# EAGLE design kitchensink_esp32_mini (EAGLE 9.6.2)

## Sheet 1 of 6
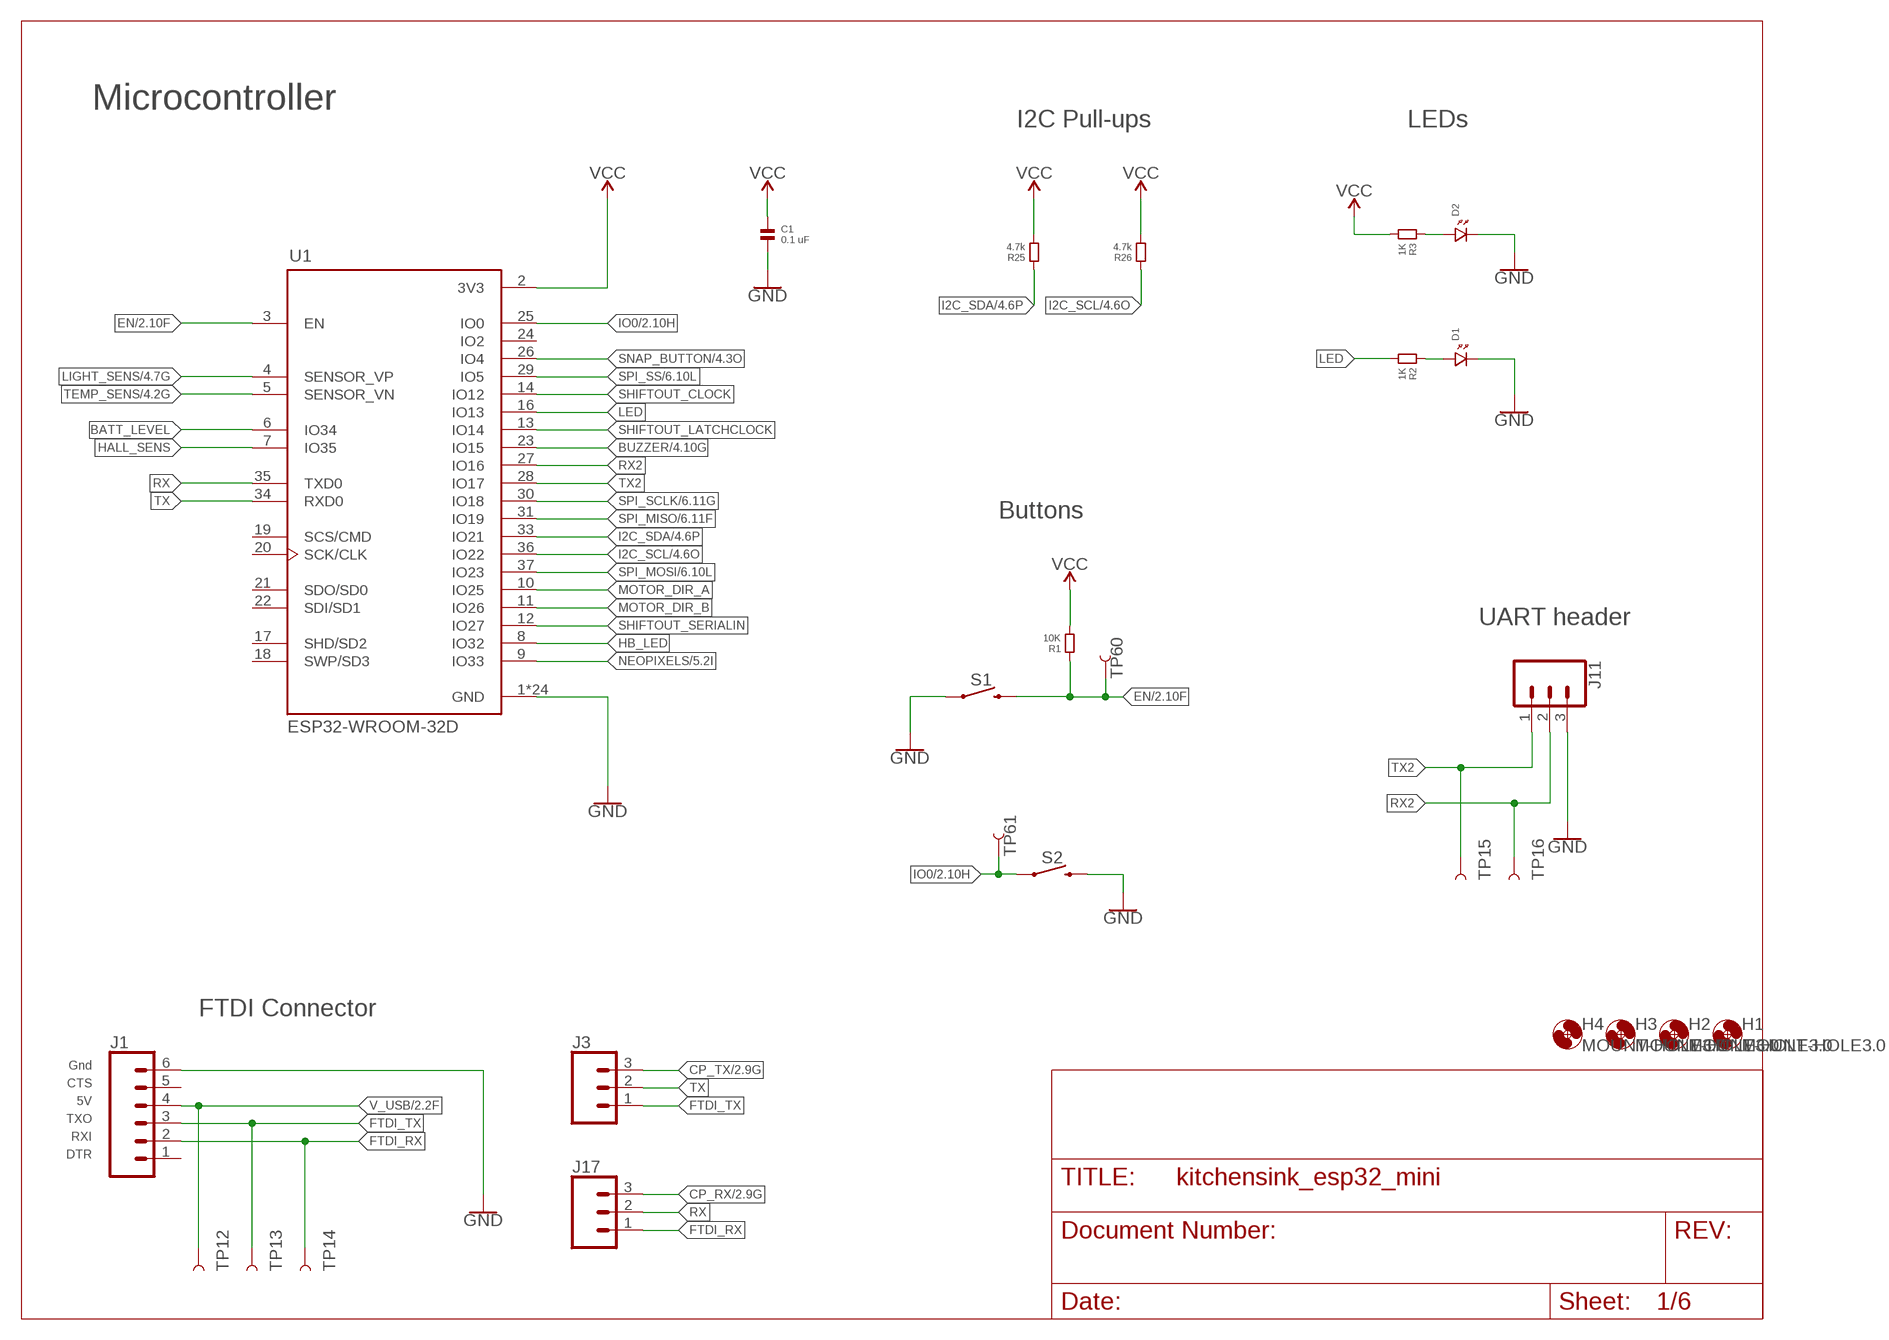
[diagram p0: schematic, sheet 1]

### Parts
C1  0.1 uF  CAPACITOR.1206  [1206]
D1  LED.1206  [1206.LED]
D2  LED.1206  [1206.LED]
H1  MOUNT-HOLE3.0  [3,0]
H2  MOUNT-HOLE3.0  [3,0]
H3  MOUNT-HOLE3.0  [3,0]
H4  MOUNT-HOLE3.0  [3,0]
J1  CONN_06  [1X06-SMD_RA_MALE_NO_HOLES]
J3  CONN_03LONGPADS  [1X03_LONGPADS]
J11  CONN_03SMD_RA_MALE  [1X03_SMD_RA_MALE]
J17  CONN_03LONGPADS  [1X03_LONGPADS]
R1  10K  RESISTOR.1206  [1206]
R2  1K  RESISTOR.1206  [1206]
R3  1K  RESISTOR.1206  [1206]
R25  4.7k  RESISTOR.1206  [1206]
R26  4.7k  RESISTOR.1206  [1206]
S1  MOMENTARY-SWITCH-SPST-SMD-5.2MM  [TACTILE_SWITCH_SMD_5.2MM]
S2  MOMENTARY-SWITCH-SPST-SMD-5.2MM  [TACTILE_SWITCH_SMD_5.2MM]
TP12  TEST-POINT3X5  [PAD.03X.05]
TP13  TEST-POINT3X5  [PAD.03X.05]
TP14  TEST-POINT3X5  [PAD.03X.05]
TP15  TEST-POINT3X5  [PAD.03X.05]
TP16  TEST-POINT3X5  [PAD.03X.05]
TP60  TEST-POINT3X5  [PAD.03X.05]
TP61  TEST-POINT3X5  [PAD.03X.05]
U1  ESP32-WROOM-32D  [MODULE_ESP32-WROOM-32D]

### Nets
BATT_LEVEL: U1.6(IO34)
BUZZER: U1.23(IO15) ; also sheet 4
CP_RX: J17.3 ; also sheet 2
CP_TX: J3.3 ; also sheet 2
EN: R1.1 S1.3 TP60.P$1 U1.3(EN) ; also sheet 2
FTDI_RX: J1.2 J17.1 TP14.P$1
FTDI_TX: J1.3 J3.1 TP13.P$1
GND: D1.P$2 D2.P$2 J1.6 J11.3 S1.1 U1.1(GND) U1.15(GND) U1.38(GND) U1.39_1(GND) U1.39_2(GND) U1.39_3(GND) U1.39_4(GND) U1.39_5(GND) U1.39_6(GND) U1.39_7(GND) U1.39_8(GND) U1.39_9(GND) U1.39_10(GND) U1.39_11(GND) U1.39_12(GND) U1.39_13(GND) U1.39_14(GND) U1.39_15(GND) U1.39_16(GND) U1.39_17(GND) U1.39_18(GND) U1.39_19(GND) U1.39_20(GND) U1.39_21(GND) ; also sheet 2,3,4,5,6
HALL_SENS: U1.7(IO35)
HB_LED: U1.8(IO32)
I2C_SCL: R26.1 U1.36(IO22) ; also sheet 4,6
I2C_SDA: R25.1 U1.33(IO21) ; also sheet 4,6
IO0: S2.1 TP61.P$1 U1.25(IO0) ; also sheet 2
LED: R2.2 U1.16(IO13)
LIGHT_SENS: U1.4(SENSOR_VP) ; also sheet 4
MOTOR_DIR_A: U1.10(IO25)
MOTOR_DIR_B: U1.11(IO26)
N$2: C1.1 ; supply symbol labelled VCC
N$3: C1.2 S2.3 ; supply symbol labelled GND
N$7: D1.P$1 R2.1
N$9: D2.P$1 R3.1
NEOPIXELS: U1.9(IO33) ; also sheet 5
RX: J17.2 U1.35(TXD0)
RX2: J11.2 TP16.P$1 U1.27(IO16)
SHIFTOUT_CLOCK: U1.14(IO12)
SHIFTOUT_LATCHCLOCK: U1.13(IO14)
SHIFTOUT_SERIALIN: U1.12(IO27)
SNAP_BUTTON: U1.26(IO4) ; also sheet 4
SPI_MISO: U1.31(IO19) ; also sheet 6
SPI_MOSI: U1.37(IO23) ; also sheet 6
SPI_SCLK: U1.30(IO18) ; also sheet 6
SPI_SS: U1.29(IO5) ; also sheet 6
TEMP_SENS: U1.5(SENSOR_VN) ; also sheet 4
TX: J3.2 U1.34(RXD0)
TX2: J11.1 TP15.P$1 U1.28(IO17)
V_USB: J1.4 TP12.P$1 ; also sheet 2,3
VCC: R1.2 R3.2 R25.2 R26.2 U1.2(3V3) ; also sheet 2,3,4,5,6
Unconnected: J1.1 J1.5 U1.17(SHD/SD2) U1.18(SWP/SD3) U1.19(SCS/CMD) U1.20(SCK/CLK) U1.21(SDO/SD0) U1.22(SDI/SD1) U1.24(IO2)

### Notes on the sheet
- Microcontroller
- I2C Pull-ups | LEDs
- Buttons
- UART header
- FTDI Connector
- Gnd
- CTS
- 5V
- TXO
- RXI
- DTR

## Sheet 2 of 6
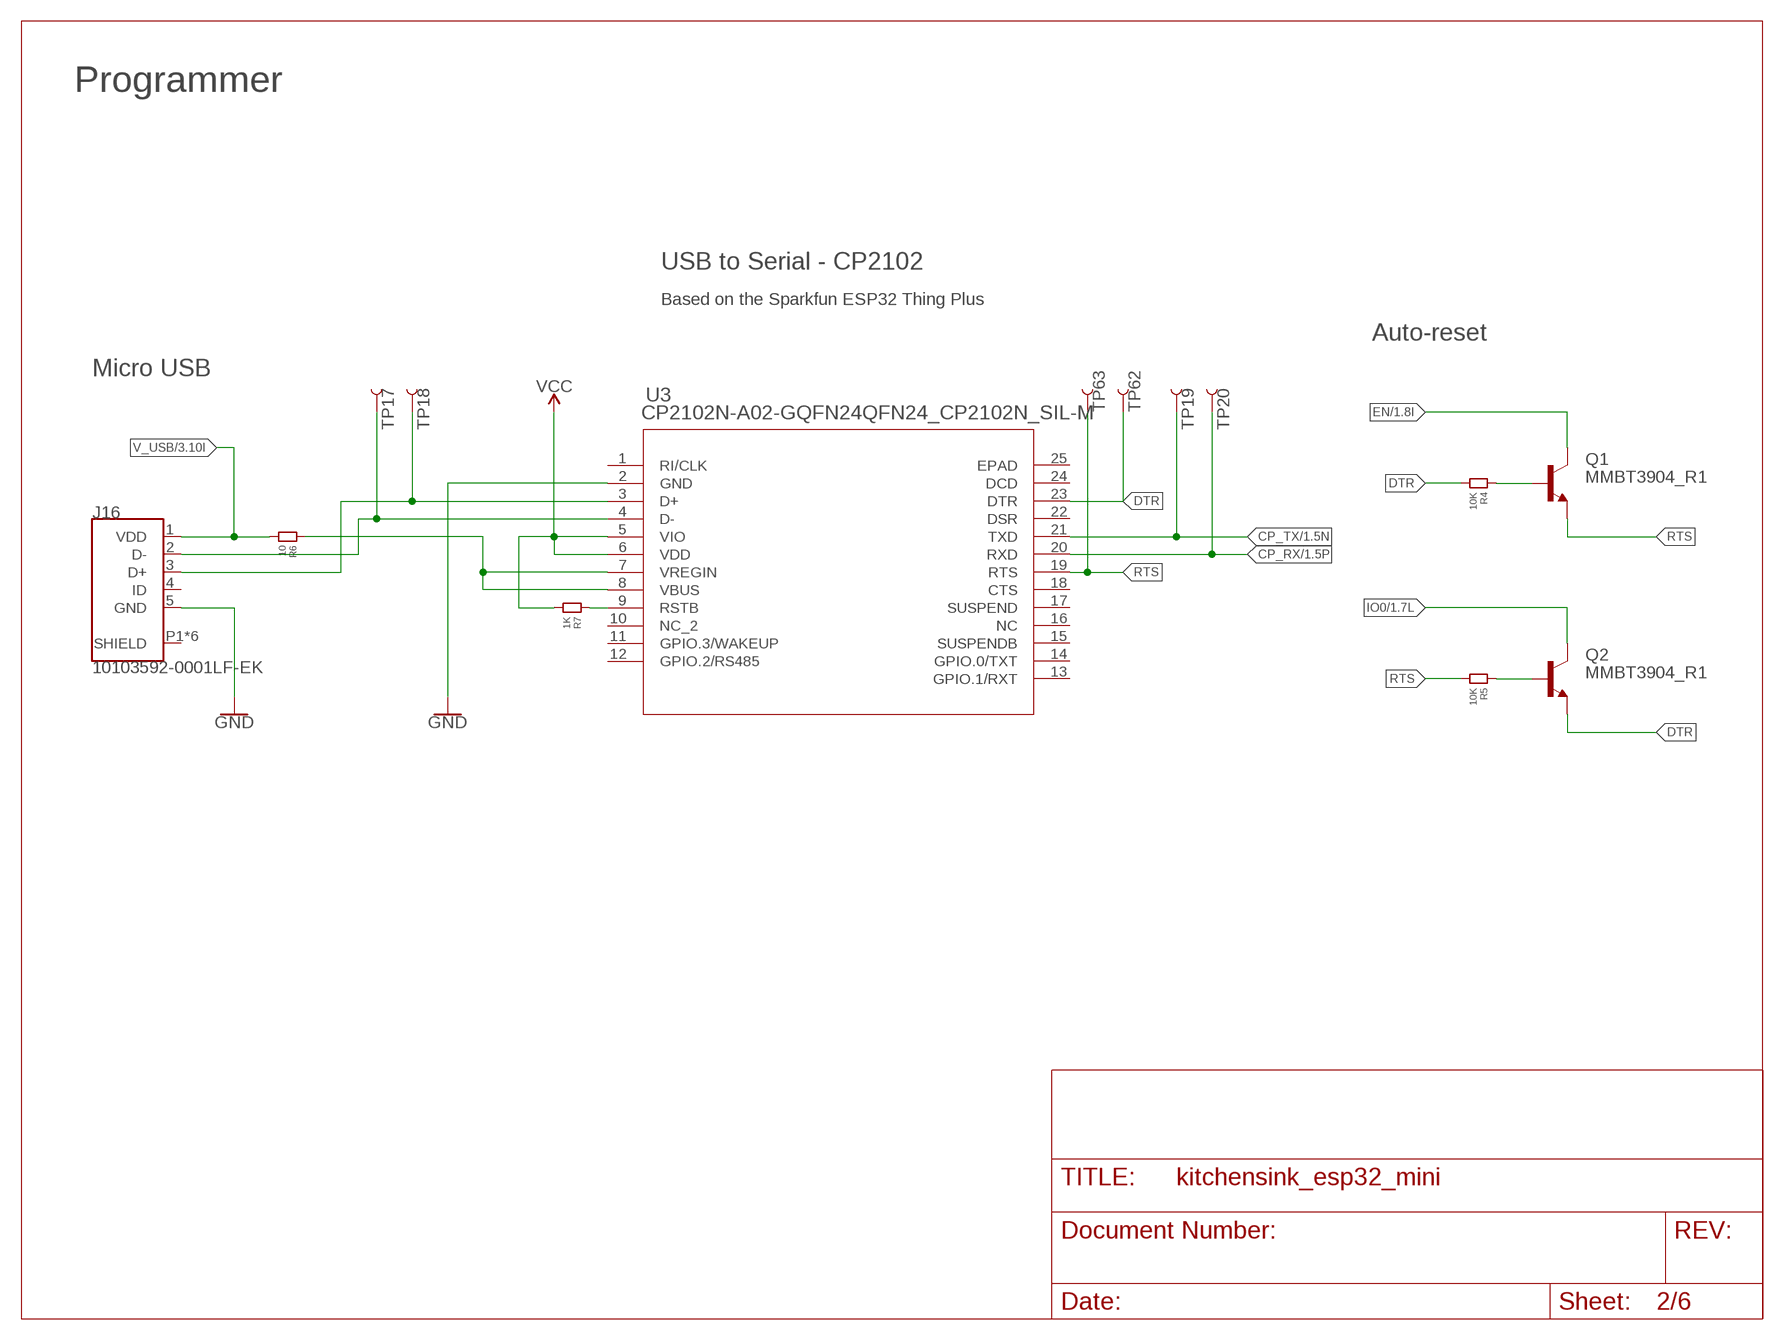
[diagram p1: schematic, sheet 2]

### Parts
J16  10103592-0001LF-EK  [AMPHENOL_10103592-0001LF]
Q1  MMBT3904_R1  BC846  [SOT23]
Q2  MMBT3904_R1  BC846  [SOT23]
R4  10K  RESISTOR.1206  [1206]
R5  10K  RESISTOR.1206  [1206]
R6  10  RESISTOR.1206  [1206]
R7  1K  RESISTOR.1206  [1206]
TP17  TEST-POINT3X5  [PAD.03X.05]
TP18  TEST-POINT3X5  [PAD.03X.05]
TP19  TEST-POINT3X5  [PAD.03X.05]
TP20  TEST-POINT3X5  [PAD.03X.05]
TP62  TEST-POINT3X5  [PAD.03X.05]
TP63  TEST-POINT3X5  [PAD.03X.05]
U3  CP2102N-A02-GQFN24QFN24_CP2102N_SIL-M  [QFN24_CP2102N_SIL-M]

### Nets
CP_RX: TP20.P$1 U3.20(RXD) ; also sheet 1
CP_TX: TP19.P$1 U3.21(TXD) ; also sheet 1
DTR: Q2.2(E) R4.2 TP62.P$1 U3.23(DTR)
EN: Q1.3(C) ; also sheet 1
GND: J16.5(GND) U3.2(GND) ; also sheet 1,3,4,5,6
IO0: Q2.3(C) ; also sheet 1
N$1: R6.1 U3.7(VREGIN) U3.8(VBUS)
N$5: J16.3(D+) TP18.P$1 U3.3(D+)
N$6: J16.2(D-) TP17.P$1 U3.4(D-)
N$10: Q1.1(B) R4.1
N$11: Q2.1(B) R5.1
N$12: R7.1 U3.9(RSTB)
RTS: Q1.2(E) R5.2 TP63.P$1 U3.19(RTS)
V_USB: J16.1(VDD) R6.2 ; also sheet 1,3
VCC: R7.2 U3.5(VIO) U3.6(VDD) ; also sheet 1,3,4,5,6
Unconnected: J16.4(ID) U3.1(RI/CLK) U3.10(NC_2) U3.11(GPIO.3/WAKEUP) U3.12(GPIO.2/RS485) U3.13(GPIO.1/RXT) U3.14(GPIO.0/TXT) U3.15(SUSPENDB) U3.16(NC) U3.17(SUSPEND) U3.18(CTS) U3.22(DSR) U3.24(DCD) U3.25(EPAD)

### Notes on the sheet
- Programmer
- USB to Serial - CP2102
- Based on the Sparkfun ESP32 Thing Plus
- Auto-reset
- Micro USB

## Sheet 3 of 6
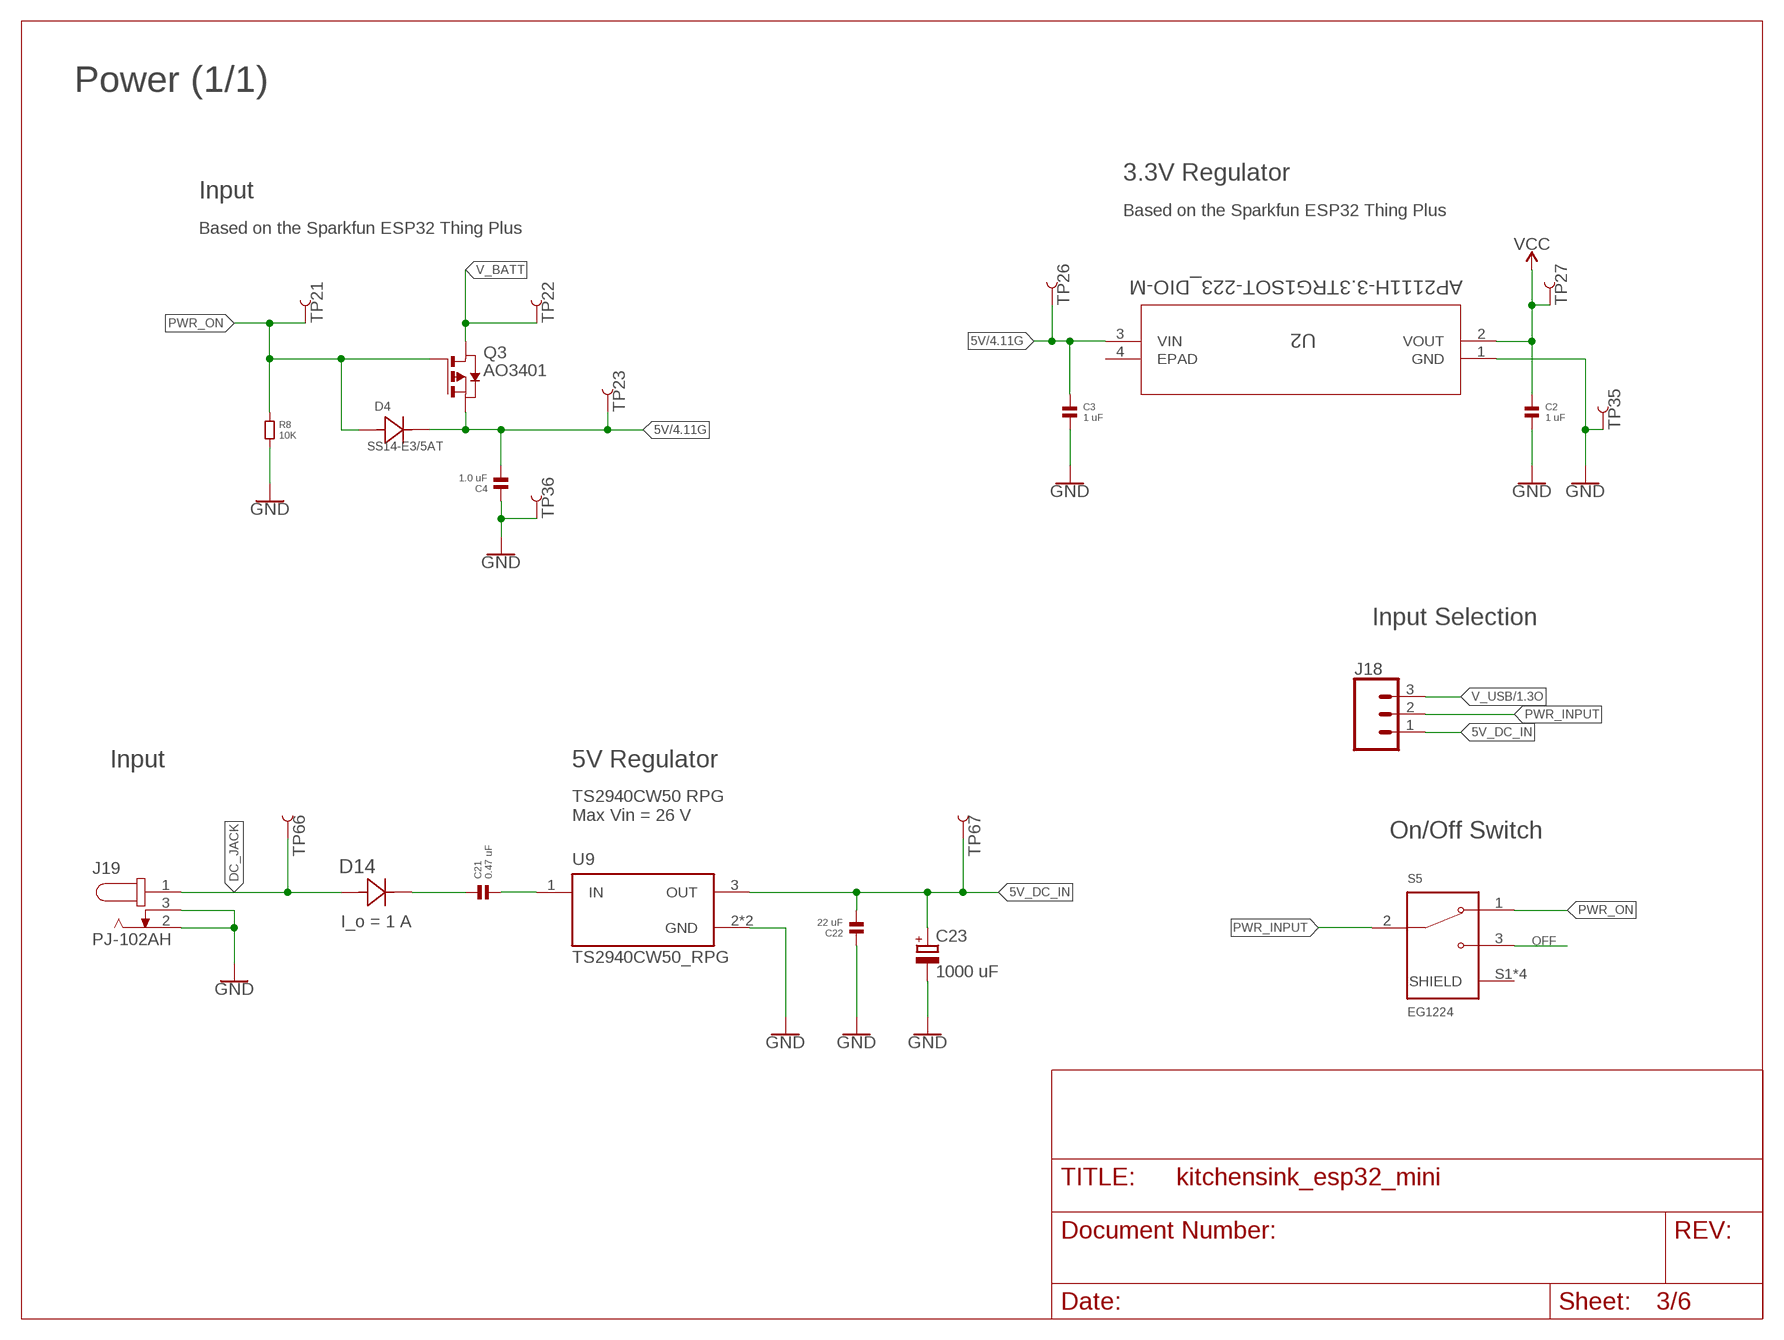
[diagram p2: schematic, sheet 3]

### Parts
C2  1 uF  CAPACITOR.1206  [1206]
C3  1 uF  CAPACITOR.1206  [1206]
C4  1.0 uF  CAPACITOR.1206  [1206]
C21  0.47 uF  CAPACITOR.1206  [1206]
C22  22 uF  CAPACITOR.1206  [1206]
C23  1000 uF  CPOL-EU140CLH-1010  [140CLH-1010]
D4  SS14-E3/5AT  [DIODE_DO214AC]
D14  RS1BB-13-FSMA_DIO-M  [SMA_DIO-M]
J18  CONN_03  [1X03]
J19  PJ-102AH  [CUI_PJ-102AH]
Q3  AO3401  [SOT23]
R8  10K  RESISTOR.1206  [1206]
S5  EG1224  [SW_EG1224]
TP21  TEST-POINT3X5  [PAD.03X.05]
TP22  TEST-POINT3X5  [PAD.03X.05]
TP23  TEST-POINT3X5  [PAD.03X.05]
TP26  TEST-POINT3X5  [PAD.03X.05]
TP27  TEST-POINT3X5  [PAD.03X.05]
TP35  TEST-POINT3X5  [PAD.03X.05]
TP36  TEST-POINT3X5  [PAD.03X.05]
TP66  TEST-POINT3X5  [PAD.03X.05]
TP67  TEST-POINT3X5  [PAD.03X.05]
U2  AP2111H-3.3TRG1SOT-223_DIO-M  [SOT-223_DIO-M]
U9  TS2940CW50_RPG  [VREG_TS2940CW50_RPG]

### Nets
5V: C3.1 C4.2 D4.1 Q3.2(S) TP23.P$1 TP26.P$1 U2.3(VIN) ; also sheet 4,5
5V_DC_IN: C22.2 C23.+ J18.1 TP67.P$1 U9.3(OUT)
DC_JACK: D14.2 J19.1 TP66.P$1
GND: C2.2 C3.2 C4.1 C22.1 C23.- J19.2 J19.3 R8.2 TP35.P$1 TP36.P$1 U2.1(GND) U9.2(GND) U9.4(GND) ; also sheet 1,2,4,5,6
N$32: C21.2 U9.1(IN)
N$43: C21.1 D14.1
OFF: S5.3
PWR_INPUT: J18.2 S5.2
PWR_ON: D4.2 Q3.1(G) R8.1 S5.1 TP21.P$1
V_BATT: Q3.3(D) TP22.P$1
V_USB: J18.3 ; also sheet 1,2
VCC: C2.1 TP27.P$1 U2.2(VOUT) ; also sheet 1,2,4,5,6
Unconnected: S5.S1(SHIELD) S5.S2(SHIELD) S5.S3(SHIELD) S5.S4(SHIELD) U2.4(EPAD)

### Notes on the sheet
- Power (1/1)
- 3.3V Regulator
- Input
- Based on the Sparkfun ESP32 Thing Plus
- Based on the Sparkfun ESP32 Thing Plus
- Input Selection
- Input | 5V Regulator
- TS2940CW50 RPG
  Max Vin = 26 V
- On/Off Switch
- I_o = 1 A

## Sheet 4 of 6
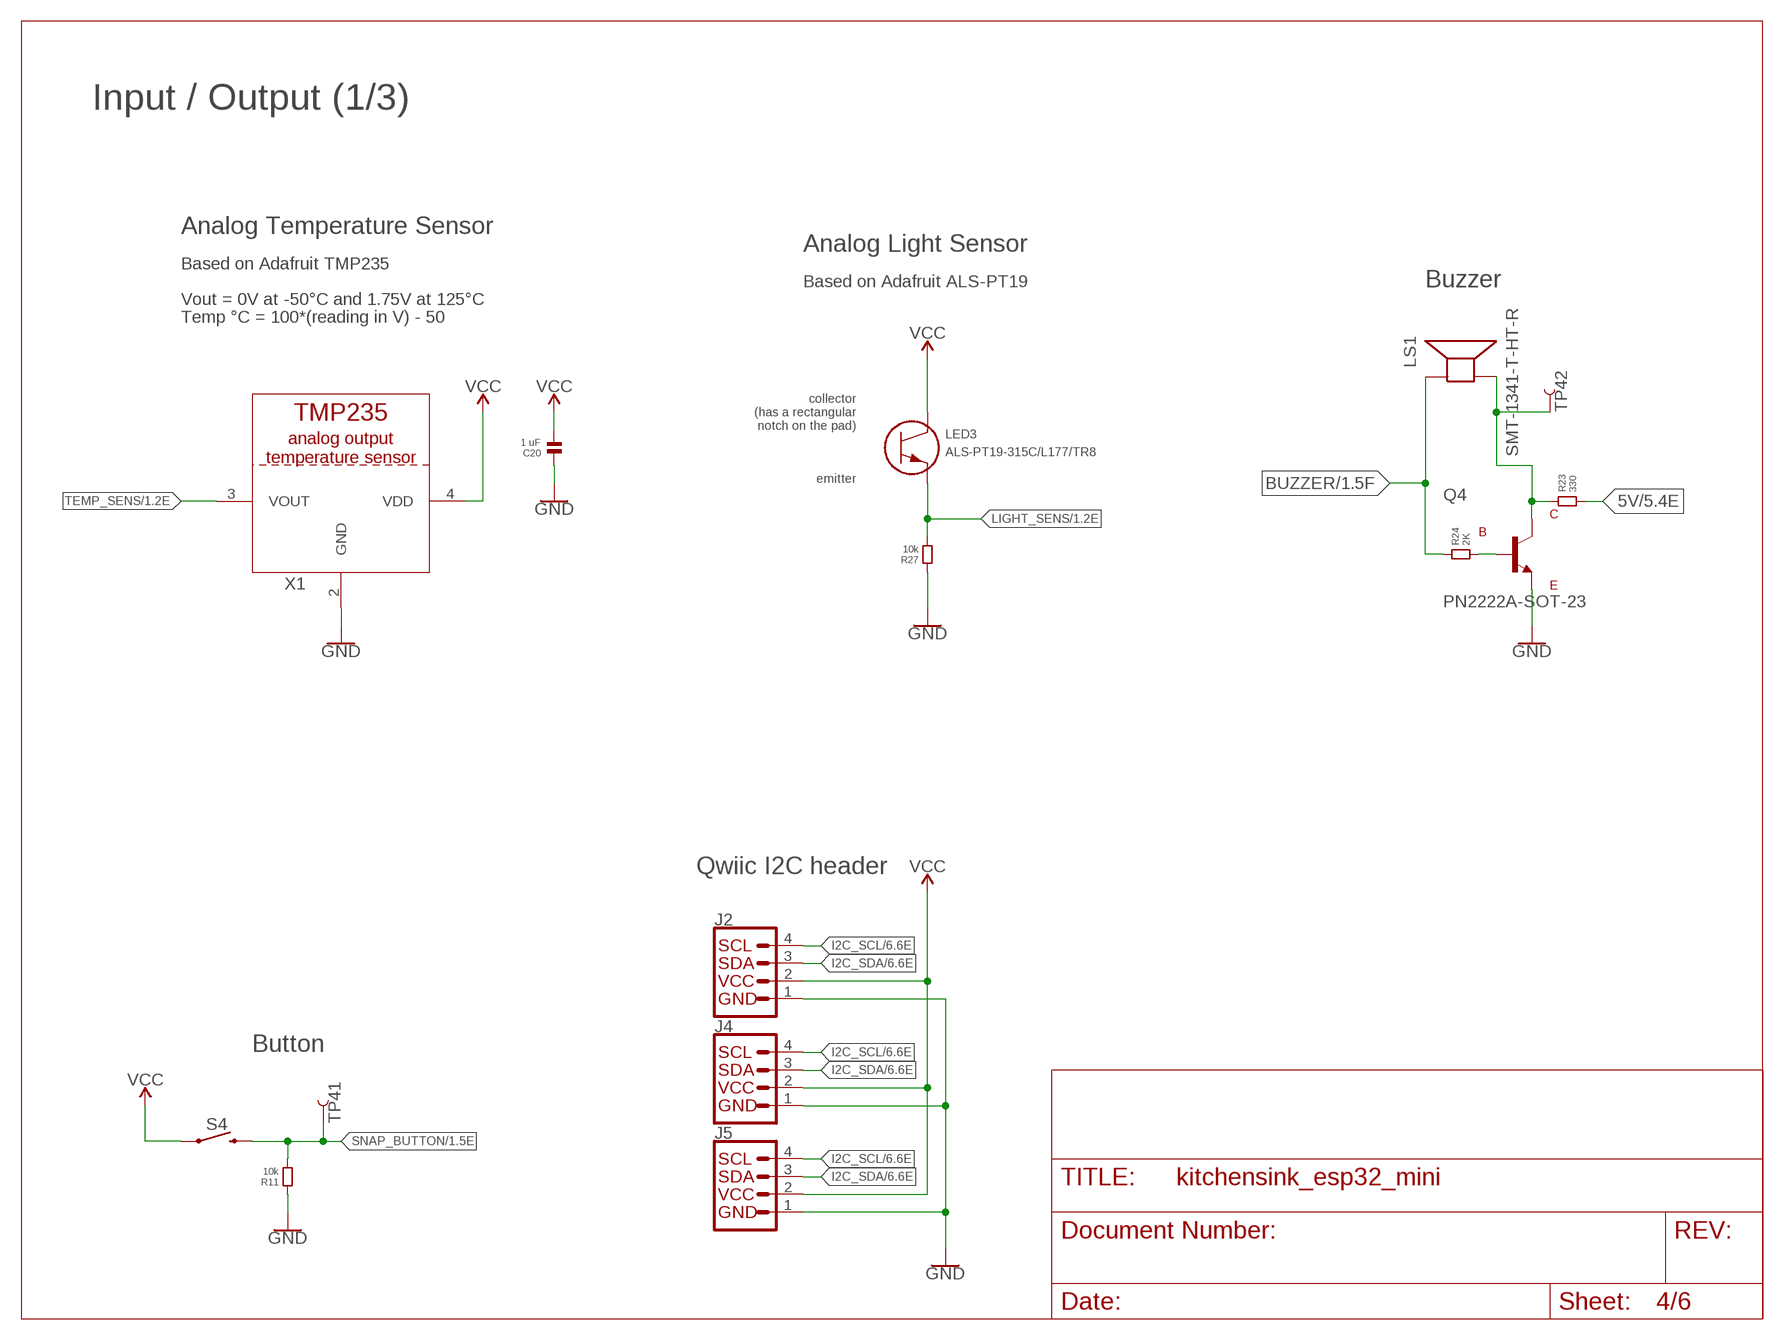
[diagram p3: schematic, sheet 4]

### Parts
C20  1 uF  CAPACITOR.1206  [1206]
J2  QWIIC_CONNECTORJS-1MM  [1X04_1MM_RA]
J4  QWIIC_CONNECTORJS-1MM  [1X04_1MM_RA]
J5  QWIIC_CONNECTORJS-1MM  [1X04_1MM_RA]
LED3  ALS-PT19-315C/L177/TR8  [LED_77/TR8_EVE]
LS1  SMT-1341-T-HT-R  [XDCR_SMT-1341-T-HT-R]
Q4  PN2222A-SOT-23  [PN2222A-SOT-23]
R11  10k  RESISTOR.1206  [1206]
R23  330  RESISTOR.1206  [1206]
R24  2K  RESISTOR.1206  [1206]
R27  10k  RESISTOR.1206  [1206]
S4  MOMENTARY-SWITCH-SPST-SMD-5.2MM  [TACTILE_SWITCH_SMD_5.2MM]
TP41  TEST-POINT3X5  [PAD.03X.05]
TP42  TEST-POINT3X5  [PAD.03X.05]
X1  TMP235_DCKR  [SC70-5]

### Nets
5V: R23.2 ; also sheet 3,5
BUZZER: LS1.P R24.1 ; also sheet 1
GND: C20.1 J2.1(GND) J4.1(GND) J5.1(GND) Q4.EMITTER R11.1 R27.1 X1.2(GND) ; also sheet 1,2,3,5,6
I2C_SCL: J2.4(SCL) J4.4(SCL) J5.4(SCL) ; also sheet 1,6
I2C_SDA: J2.3(SDA) J4.3(SDA) J5.3(SDA) ; also sheet 1,6
LIGHT_SENS: LED3.2 R27.2 ; also sheet 1
N$33: LS1.N Q4.COLLECTOR R23.1 TP42.P$1
N$35: Q4.BASE R24.2
SNAP_BUTTON: R11.2 S4.3 TP41.P$1 ; also sheet 1
TEMP_SENS: X1.3(VOUT) ; also sheet 1
VCC: C20.2 J2.2(VCC) J4.2(VCC) J5.2(VCC) LED3.1 S4.1 X1.4(VDD) ; also sheet 1,2,3,5,6

### Notes on the sheet
- Input / Output (1/3)
- Analog Temperature Sensor
- Analog Light Sensor
- Based on Adafruit TMP235
- Based on Adafruit ALS-PT19 | Buzzer
- Vout = 0V at -50°C and 1.75V at 125°C
- Temp °C = 100*(reading in V) - 50
- collector
  (has a rectangular
  notch on the pad)
- emitter
- Qwiic I2C header
- Button

## Sheet 5 of 6
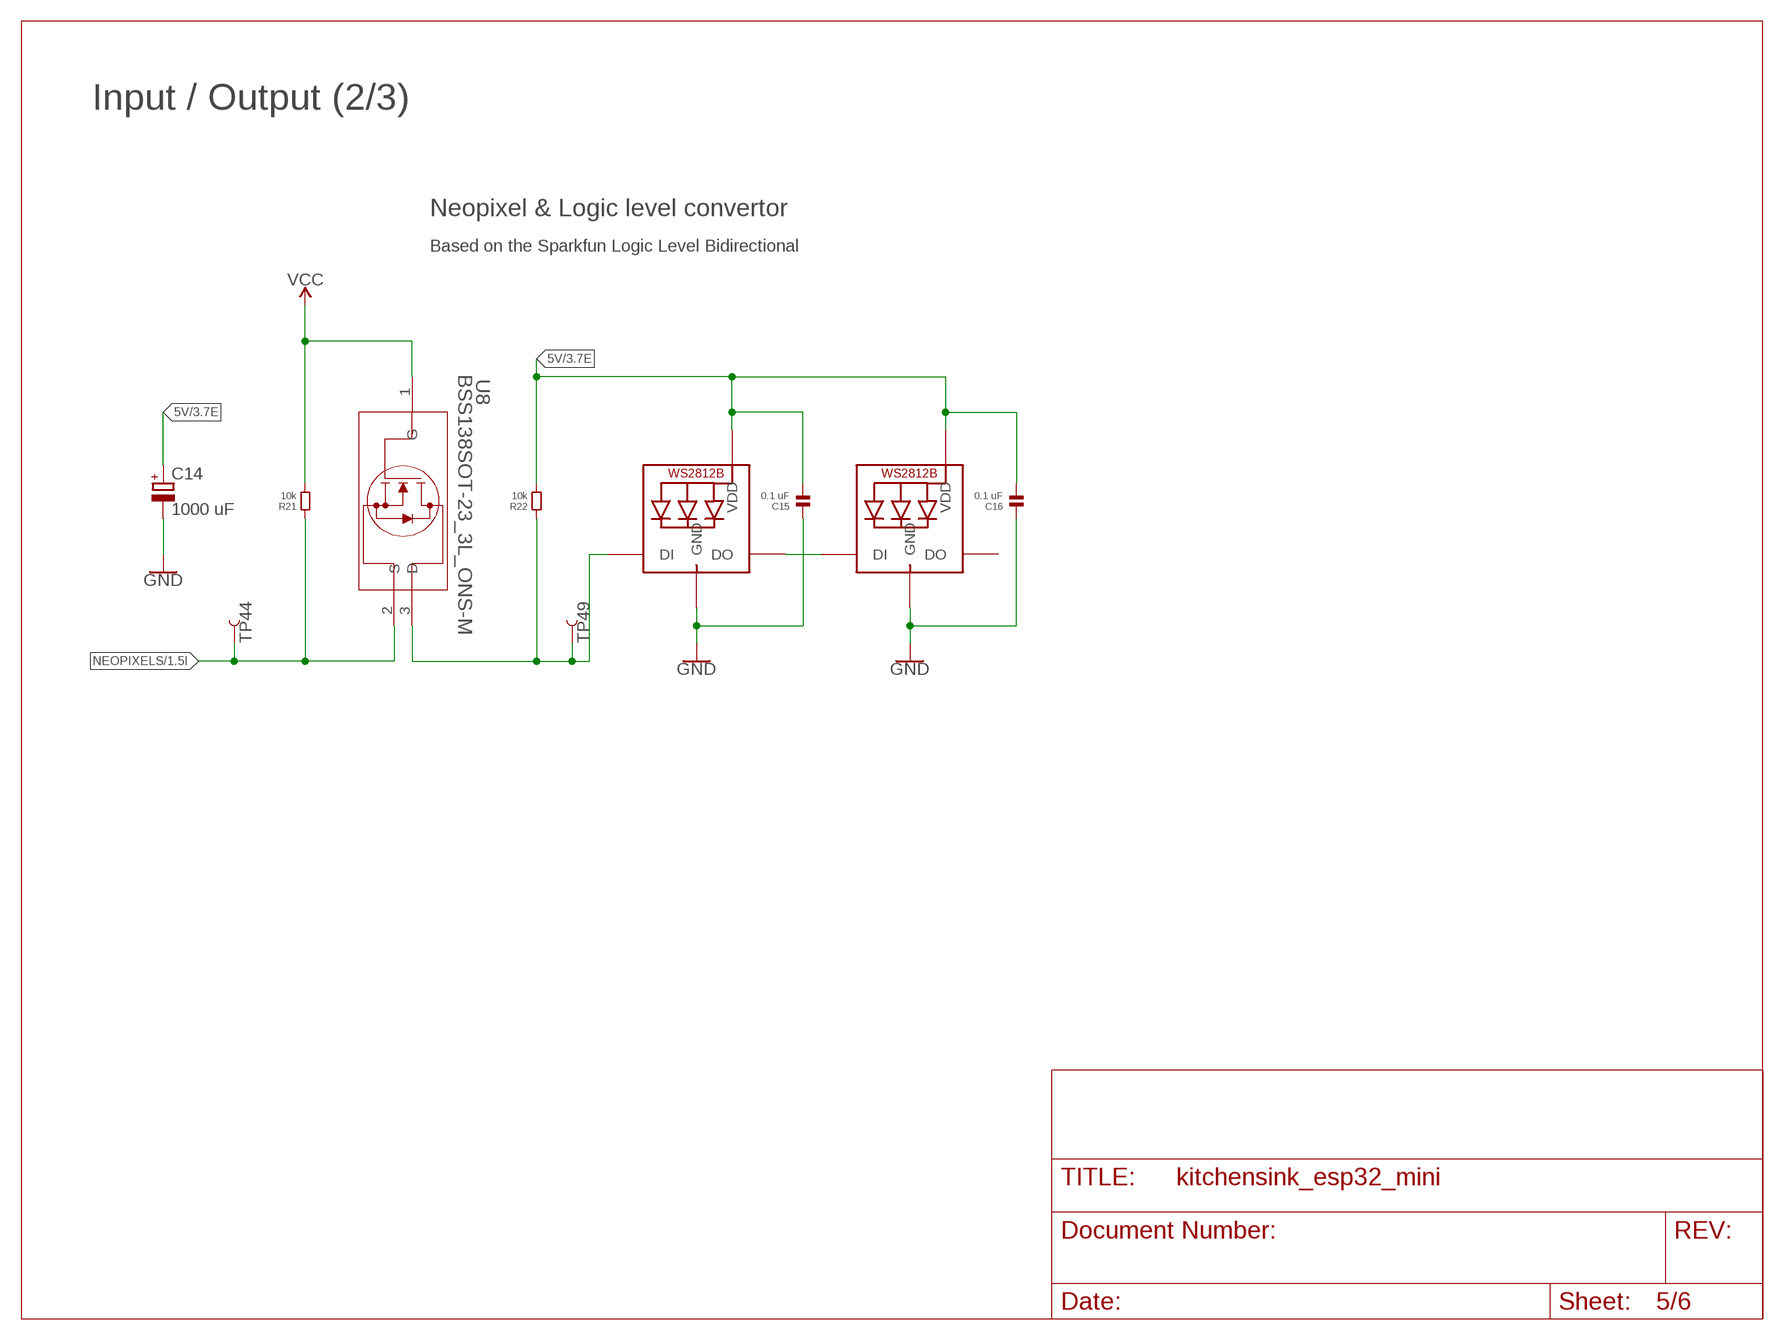
[diagram p4: schematic, sheet 5]

### Parts
C14  1000 uF  CPOL-EU140CLH-1010  [140CLH-1010]
C15  0.1 uF  CAPACITOR.1206  [1206]
C16  0.1 uF  CAPACITOR.1206  [1206]
LED1  WS2812B5050  [WS2812B]
LED2  WS2812B5050  [WS2812B]
R21  10k  RESISTOR.1206  [1206]
R22  10k  RESISTOR.1206  [1206]
TP44  TEST-POINT3X5  [PAD.03X.05]
TP49  TEST-POINT3X5  [PAD.03X.05]
U8  BSS138SOT-23_3L_ONS-M  [SOT-23_3L_ONS-M]

### Nets
5V: C14.+ C15.2 C16.2 LED1.1-VDD(VDD) LED2.1-VDD(VDD) R22.2 ; also sheet 3,4
GND: C14.- C15.1 C16.1 LED1.3-GND(GND) LED2.3-GND(GND) ; also sheet 1,2,3,4,6
N$30: LED1.4-DIN(DI) R22.1 TP49.P$1 U8.3(D)
N$34: LED1.2-DOUT(DO) LED2.4-DIN(DI)
NEOPIXELS: R21.1 TP44.P$1 U8.2(S) ; also sheet 1
VCC: R21.2 U8.1(G) ; also sheet 1,2,3,4,6
Unconnected: LED2.2-DOUT(DO)

### Notes on the sheet
- Input / Output (2/3)
- Neopixel & Logic level convertor
- Based on the Sparkfun Logic Level Bidirectional

## Sheet 6 of 6
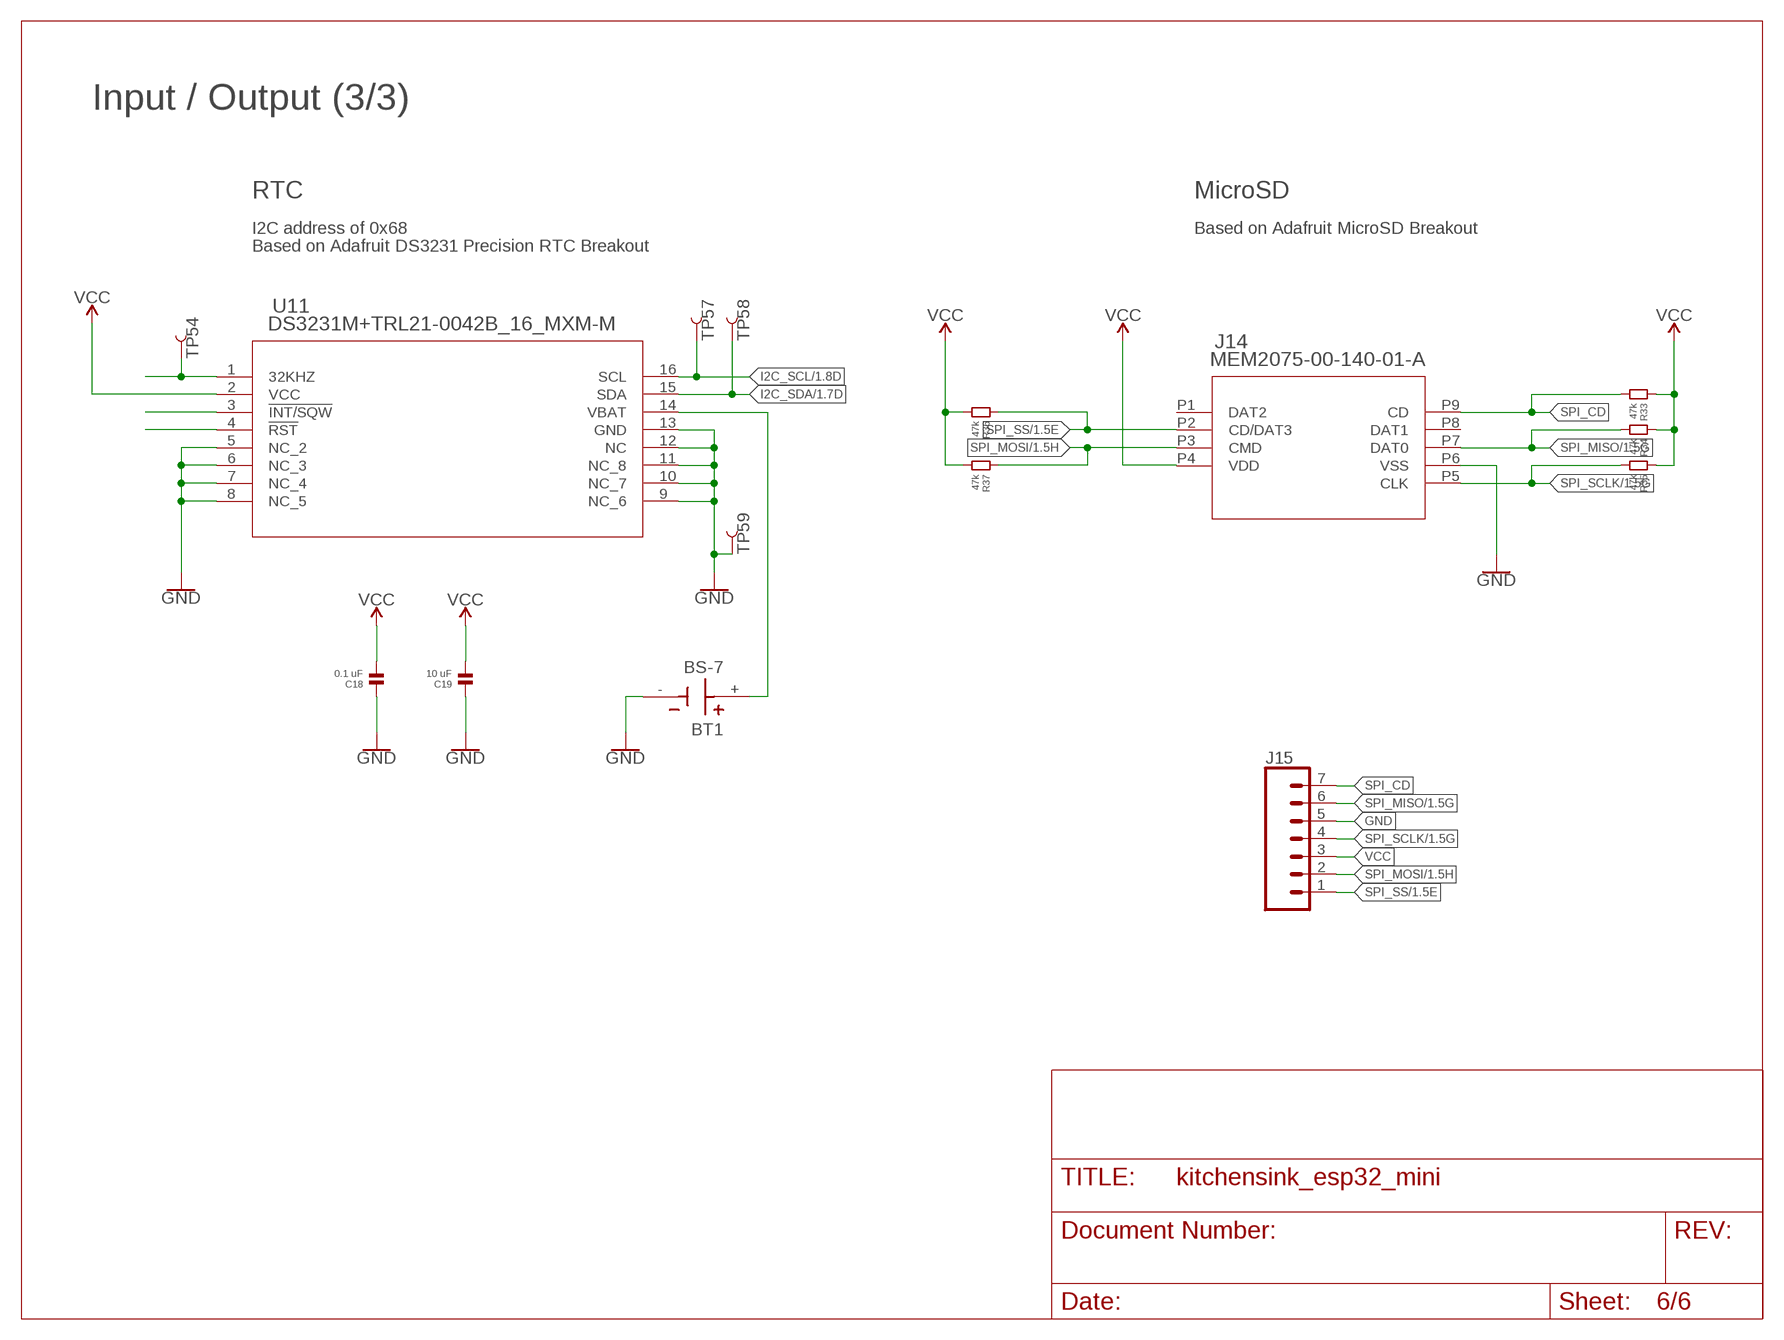
[diagram p5: schematic, sheet 6]

### Parts
BT1  BS-7  [BAT_BS-7]
C18  0.1 uF  CAPACITOR.1206  [1206]
C19  10 uF  CAPACITOR.1206  [1206]
J14  MEM2075-00-140-01-A  [MEM2075-00-140-01-A_GCT]
J15  CONN_07LONGPADS  [1X07_LONGPADS]
R33  47k  RESISTOR.1206  [1206]
R34  47k  RESISTOR.1206  [1206]
R35  47k  RESISTOR.1206  [1206]
R36  47k  RESISTOR.1206  [1206]
R37  47k  RESISTOR.1206  [1206]
TP54  TEST-POINT3X5  [PAD.03X.05]
TP57  TEST-POINT3X5  [PAD.03X.05]
TP58  TEST-POINT3X5  [PAD.03X.05]
TP59  TEST-POINT3X5  [PAD.03X.05]
U11  DS3231M+TRL21-0042B_16_MXM-M  [21-0042B_16_MXM-M]

### Nets
GND: BT1.- C18.1 C19.1 J14.P6(VSS) J15.5 TP59.P$1 U11.5(NC_2) U11.6(NC_3) U11.7(NC_4) U11.8(NC_5) U11.9(NC_6) U11.10(NC_7) U11.11(NC_8) U11.12(NC) U11.13(GND) ; also sheet 1,2,3,4,5
I2C_SCL: TP57.P$1 U11.16(SCL) ; also sheet 1,4
I2C_SDA: TP58.P$1 U11.15(SDA) ; also sheet 1,4
N$18: TP54.P$1 U11.1(32KHZ)
N$19: U11.3(!INT/SQW)
N$23: U11.4(!RST)
N$24: BT1.+ U11.14(VBAT)
SPI_CD: J14.P9(CD) J15.7 R33.2
SPI_MISO: J14.P7(DAT0) J15.6 R34.2 ; also sheet 1
SPI_MOSI: J14.P3(CMD) J15.2 R37.1 ; also sheet 1
SPI_SCLK: J14.P5(CLK) J15.4 R35.2 ; also sheet 1
SPI_SS: J14.P2(CD/DAT3) J15.1 R36.1 ; also sheet 1
VCC: C18.2 C19.2 J14.P4(VDD) J15.3 R33.1 R34.1 R35.1 R36.2 R37.2 U11.2(VCC) ; also sheet 1,2,3,4,5
Unconnected: J14.P1(DAT2) J14.P8(DAT1)

### Notes on the sheet
- Input / Output (3/3)
- RTC | MicroSD
- I2C address of 0x68 | Based on Adafruit MicroSD Breakout
- Based on Adafruit DS3231 Precision RTC Breakout

## Power pins joined to a net without a drawn wire
SHIELD: J16.P1(SHIELD) J16.P2(SHIELD) J16.P3(SHIELD) J16.P4(SHIELD) J16.P5(SHIELD) J16.P6(SHIELD)

## Library data of the parts
BT1 = UltraLibrarianParts:BS-7: BATTERY HOLDER COIN 20MM PC PIN Check availability <https://pricing.snapeda.com/parts/BS-7/MPD%20%28Memory/view-part?ref=eda>; AVAILABILITY: In Stock; DESCRIPTION: BATTERY HOLDER COIN 20MM PC PIN; MF: MPD (Memory; MP: BS-7; PACKAGE: None; PRICE: None; PURCHASE-URL: https://pricing.snapeda.com/search/part/BS-7/?ref=eda
C1-C4 C15 C16 C18-C22 = standardparts:CAPACITOR
C14 C23 = rcl:CPOL-EU: POLARIZED CAPACITOR, European symbol; SPICEPREFIX: C
D1 D2 = standardparts:LED
D4 = UltraLibrarianParts:SS14-E3/5AT; COPYRIGHT: Copyright (C) 2022 Ultra Librarian. All rights reserved.; DIGI-KEY_PART_NUMBER_1: SS14-E3/5ATGICT-ND; DIGI-KEY_PART_NUMBER_2: SS14-E3/5ATGIDKR-ND; DIGI-KEY_PART_NUMBER_3: SS14-E3/5ATGITR-ND; MANUFACTURER_PART_NUMBER: SS14-E3/5AT; MFR_NAME: Vishay
D14 = UltraLibrarianParts:RS1BB-13-F; COPYRIGHT: Copyright (C) 2022 Ultra Librarian. All rights reserved.; DIGI-KEY_PART_NUMBER_1: RS1BB-FDICT-ND; DIGI-KEY_PART_NUMBER_2: RS1BB-FDIDKR-ND; DIGI-KEY_PART_NUMBER_3: RS1BB-FDITR-ND; MANUFACTURER_PART_NUMBER: RS1BB-13-F; MFR_NAME: Diodes Inc
H1-H4 = holes:MOUNT-HOLE: MOUNTING HOLE with drill center marker
J1 = Hippo-PS:CONN_06: Multi connection point. Often used as Generic Header-pin footprint for 0.1 inch spaced/style header connections On any of the 0.1 inch spaced packages, you can populate with these: Break Away Headers - Straight <https://www.sparkfun.com/products/116> (PRT-00116) Break Away Male Headers - Right Angle <https://www.sparkfun.com/products/553> (PRT-00553) Female Headers <https://www.sparkfun.com/products/115> (PRT-00115) Break Away Headers - Machine Pin <https://www.sparkfun.com/products/117> (PRT-00117) Break Away Female Headers - Swiss Machine Pin <https://www.sparkfun.com/products/743> (PRT-00743) Arduino Stackable Header - 6 Pin <https://www.sparkfun.com/products/9280> (PRT-09280) For SCREWTERMINALS and SPRING TERMINALS visit here: Screw Terimnals on SparkFun.com <https://www.sparkfun.com/search/results?term=Screw+Terminals> (5mm/3.5mm/2.54mm spacing) This device is also useful as a general connection point to wire up your design to another part of your project. Our various solder wires solder well into these plated through hole pads. Hook-Up Wire - Assortment (Stranded, 22 AWG) <https://www.sparkfun.com/products/11375> (PRT-11375) Hook-Up Wire - Assortment (Solid Core, 22 AWG) <https://www.sparkfun.com/products/11367> (PRT-11367) View the entire wire category on our website here <https://www.sparkfun.com/categories/141>
J2 J4 J5 = SparkFun-Connectors:QWIIC_CONNECTOR: SparkFun I2C Standard Qwiic Connector An SMD 1mm pitch JST connector makes it easy and quick (get it? Qwiic?) to connect I2C devices to each other. The Qwiic system <http://www.sparkfun.com/qwiic> enables fast and solderless connection between popular platforms and various sensors and actuators. We carry 200mm <https://www.sparkfun.com/products/14204>, 100mm <https://www.sparkfun.com/products/14205>, 50mm <https://www.sparkfun.com/products/14206>, and breadboard friendly <https://www.sparkfun.com/products/14207> Qwiic cables. We also offer 10 pcs strips <https://www.sparkfun.com/products/14323> the SMD connectors.
J3 J17 J18 = SparkFun-Connectors:CONN_03: Multi connection point. Often used as Generic Header-pin footprint for 0.1 inch spaced/style header connections On any of the 0.1 inch spaced packages, you can populate with these: Break Away Headers - Straight <https://www.sparkfun.com/products/116> (PRT-00116) Break Away Male Headers - Right Angle <https://www.sparkfun.com/products/553> (PRT-00553) Female Headers <https://www.sparkfun.com/products/115> (PRT-00115) Break Away Headers - Machine Pin <https://www.sparkfun.com/products/117> (PRT-00117) Break Away Female Headers - Swiss Machine Pin <https://www.sparkfun.com/products/743> (PRT-00743) Stackable Header - 3 Pin (Female, 0.1") <https://www.sparkfun.com/products/13875> (PRT-13875) For SCREWTERMINALS and SPRING TERMINALS visit here: Screw Terimnals on SparkFun.com <https://www.sparkfun.com/search/results?term=Screw+Terminals> (5mm/3.5mm/2.54mm spacing) This device is also useful as a general connection point to wire up your design to another part of your project. Our various solder wires solder well into these plated through hole pads. Hook-Up Wire - Assortment (Stranded, 22 AWG) <https://www.sparkfun.com/products/11375> (PRT-11375) Hook-Up Wire - Assortment (Solid Core, 22 AWG) <https://www.sparkfun.com/products/11367> (PRT-11367) View the entire wire category on our website here <https://www.sparkfun.com/categories/141> Special notes: Molex polarized connector foot print use with SKU : PRT-08232 with associated crimp pins and housings.
J11 = SparkFun-Connectors:CONN_03: Multi connection point. Often used as Generic Header-pin footprint for 0.1 inch spaced/style header connections On any of the 0.1 inch spaced packages, you can populate with these: Break Away Headers - Straight <https://www.sparkfun.com/products/116> (PRT-00116) Break Away Male Headers - Right Angle <https://www.sparkfun.com/products/553> (PRT-00553) Female Headers <https://www.sparkfun.com/products/115> (PRT-00115) Break Away Headers - Machine Pin <https://www.sparkfun.com/products/117> (PRT-00117) Break Away Female Headers - Swiss Machine Pin <https://www.sparkfun.com/products/743> (PRT-00743) Stackable Header - 3 Pin (Female, 0.1") <https://www.sparkfun.com/products/13875> (PRT-13875) For SCREWTERMINALS and SPRING TERMINALS visit here: Screw Terimnals on SparkFun.com <https://www.sparkfun.com/search/results?term=Screw+Terminals> (5mm/3.5mm/2.54mm spacing) This device is also useful as a general connection point to wire up your design to another part of your project. Our various solder wires solder well into these plated through hole pads. Hook-Up Wire - Assortment (Stranded, 22 AWG) <https://www.sparkfun.com/products/11375> (PRT-11375) Hook-Up Wire - Assortment (Solid Core, 22 AWG) <https://www.sparkfun.com/products/11367> (PRT-11367) View the entire wire category on our website here <https://www.sparkfun.com/categories/141> Special notes: Molex polarized connector foot print use with SKU : PRT-08232 with associated crimp pins and housings.; PROD_ID: CONN-10925
J14 = UltraLibrarianParts:MEM2075-00-140-01-A; COPYRIGHT: Copyright (C) 2022 Ultra Librarian. All rights reserved.; DIGI-KEY_PART_NUMBER_1: 2073-MEM2075-00-140-01-ACT-ND; DIGI-KEY_PART_NUMBER_2: 2073-MEM2075-00-140-01-ADKR-ND; DIGI-KEY_PART_NUMBER_3: 2073-MEM2075-00-140-01-ATR-ND; MANUFACTURER_PART_NUMBER: MEM2075-00-140-01-A; MFR_NAME: Global Connector Technology
J15 = SparkFun-Connectors:CONN_07: Multi connection point. Often used as Generic Header-pin footprint for 0.1 inch spaced/style header connections On any of the 0.1 inch spaced packages, you can populate with these: Break Away Headers - Straight <https://www.sparkfun.com/products/116> (PRT-00116) Break Away Male Headers - Right Angle <https://www.sparkfun.com/products/553> (PRT-00553) Female Headers <https://www.sparkfun.com/products/115> (PRT-00115) Break Away Headers - Machine Pin <https://www.sparkfun.com/products/117> (PRT-00117) Break Away Female Headers - Swiss Machine Pin <https://www.sparkfun.com/products/743> (PRT-00743) For SCREWTERMINALS and SPRING TERMINALS visit here: Screw Terimnals on SparkFun.com <https://www.sparkfun.com/search/results?term=Screw+Terminals> (5mm/3.5mm/2.54mm spacing) This device is also useful as a general connection point to wire up your design to another part of your project. Our various solder wires solder well into these plated through hole pads. Hook-Up Wire - Assortment (Stranded, 22 AWG) <https://www.sparkfun.com/products/11375> (PRT-11375) Hook-Up Wire - Assortment (Solid Core, 22 AWG) <https://www.sparkfun.com/products/11367> (PRT-11367) View the entire wire category on our website here <https://www.sparkfun.com/categories/141> Special notes: Molex polarized connector foot print use with SKU : PRT-08231 with associated crimp pins and housings. 1MM SMD Version SKU: PRT-10208 NOTES ON THE VARIANTS LOCK and LOCK_LONGPADS... This footprint was designed to help hold the alignment of a through-hole component (i.e. 6-pin header) while soldering it into place. You may notice that each hole has been shifted either up or down by 0.005 of an inch from it's more standard position (which is a perfectly straight line). This slight alteration caused the pins (the squares in the middle) to touch the edges of the holes. Because they are alternating, it causes a "brace" to hold the component in place. 0.005 has proven to be the perfect amount of "off-center" position when using our standard breakaway headers. Although looks a little odd when you look at the bare footprint, once you have a header in there, the alteration is very hard to notice. Also,if you push a header all the way into place, it is covered up entirely on the bottom side.
J16 = UltraLibrarianParts:10103592-0001LF-EK: Conn Micro USB Type B RCP 5 POS 0.65mm Solder RA SMD 5 Terminal 1 Port T/R; ARROW_ELECTRONICS-PURCHASE-URL: https://snapeda.com/shop?store=Arrow+Electronics&id=1274744; DESCRIPTION: USB - micro B USB 2.0 Receptacle Connector 5 Position Surface Mount, Right Angle; Through Hole; DIGI-KEY_PART_NUMBER: 609-4048-1-ND; DIGIKEY-PURCHASE-URL: https://snapeda.com/shop?store=DigiKey&id=1274744; MF: Amphenol ICC; MOUSER-PURCHASE-URL: https://snapeda.com/shop?store=Mouser&id=1274744; MP: 10103592-0001LF; PACKAGE: None
J19 = UltraLibrarianParts:PJ-102AH: 2.0 mm Center Pin, 5.0 A, Right Angle, Through Hole, Tapered Pins, Dc Power Jack Connector; CUI_PURCHASE_URL: https://www.cuidevices.com/product/interconnect/connectors/dc-power-connectors/jacks/pj-102ah?utm_source=snapeda.com&utm_medium=referral&utm_campaign=snapedaBOM; DESCRIPTION: 2.0 x 6.5 mm, 5.0 A, Horizontal, Through Hole, Tapered Pins, Dc Power Jack Connector; DIGI-KEY_PART_NUMBER: CP-102AH-ND; MF: CUI Devices; MP: PJ-102AH; PACKAGE: None; PURCHASE-URL: https://pricing.snapeda.com/search/part/PJ-102AH/?ref=eda
LED1 LED2 = UltraLibrarianParts:WS2812B: Check availability <https://pricing.snapeda.com/parts/WS2812B/SparkFun%20Electronics/view-part?ref=eda>; AVAILABILITY: Not in stock; DESCRIPTION: Raspberry Pi HAT (40 pin) Wheeled Robotics Kit; MF: SparkFun Electronics; MP: WS2812B; PACKAGE: None; PRICE: None
LED3 = UltraLibrarianParts:ALS-PT19-315C/L177/TR8; COPYRIGHT: Copyright (C) 2022 Ultra Librarian. All rights reserved.; DIGI-KEY_PART_NUMBER_1: 1080-1244-2-ND; DIGI-KEY_PART_NUMBER_2: 1080-1244-1-ND; DIGI-KEY_PART_NUMBER_3: 1080-1244-6-ND; MANUFACTURER_PART_NUMBER: ALS-PT19-315C/L177/TR8; MFR_NAME: Everlight
LS1 = UltraLibrarianParts:SMT-1341-T-HT-R; DESCRIPTION: SURFACE MOUNT TRANSDUCER 5 VP-P; DIGI-KEY_PART_NUMBER: 668-SMT-1341-T-HT-RTR-ND; MF: PUI Audio, Inc.; MP: SMT-1341-T-HT-R; PACKAGE: PUI Audio, Inc.; PURCHASE-URL: https://pricing.snapeda.com/search/part/SMT-1341-T-HT-R/?ref=eda
Q1 Q2 = BC846:BC846: NPN TRANSISTOR Check availability <https://pricing.snapeda.com/parts/BC846/Rectron/view-part?ref=eda>; AVAILABILITY: In Stock; DESCRIPTION: Trans GP BJT NPN 65V 0.1A 3-Pin SOT-23; MF: Rectron; MP: BC846; PACKAGE: SOT-23-3 Rectron; PRICE: None
Q3 = AO3401:AO3401: Check availability <https://pricing.snapeda.com/parts/AO3401/Alpha%20%26%20Omega%20Semiconductor/view-part?ref=eda>; AVAILABILITY: In Stock; DESCRIPTION: P-Channel 30 V 4A (Ta) 1.4W (Ta) Surface Mount SOT-23-3; MF: Alpha & Omega Semiconductor; MP: AO3401; PACKAGE: SOT-23-3 Alpha &amp; Omega Semiconductor; PRICE: None; PURCHASE-URL: https://pricing.snapeda.com/search/part/AO3401/?ref=eda
Q4 = Hippo-PS:PN2222A-SOT-23: MMBT3904 series 40V 200mA SOT23 NPN Switching Transistor Check availability <https://pricing.snapeda.com/parts/MMBT3904%2C215/Nexperia%20USA/view-part?ref=eda>; AVAILABILITY: In Stock; DESCRIPTION: Bipolar (BJT) Transistor NPN 40 V 200 mA 300MHz 250 mW Surface Mount TO-236AB; MF: Nexperia USA; MP: MMBT3904,215; PACKAGE: SOT23-3 Nexperia USA Inc.; PRICE: None; PURCHASE-URL: https://pricing.snapeda.com/search/part/MMBT3904,215/?ref=eda
R1-R8 R11 R21-R27 R33-R37 = standardparts:RESISTOR
S1 S2 S4 = SparkFun-Switches:MOMENTARY-SWITCH-SPST: Momentary Switch (Pushbutton) - SPST Normally-open (NO) SPST momentary switches (buttons, pushbuttons). Variants PTH-12MM - 12mm square, through-hole Momentary Pushbutton Switch - 12mm Square <https://www.sparkfun.com/products/9190> (COM-09190) PTH-6.0MM, PTH-6.0MM-KIT - 6.0mm square, through-hole Mini Pushbutton Switch <https://www.sparkfun.com/products/97> (COM-00097) KIT package intended for soldering kit's - only one side of pads' copper is exposed. PTH-RIGHT-ANGLE-KIT - Right-angle, through-hole Right Angle Tactile Button <https://www.sparkfun.com/products/10791> - Used on SparkFun BigTime Watch Kit <https://www.sparkfun.com/products/11734> SMD-12MM - 12mm square, surface-mount Tactile Button - SMD (12mm) <https://www.sparkfun.com/products/12993> (COM-12993) Used on SparkFun PicoBoard <https://www.sparkfun.com/products/11888> SMD-4.5MM - 4.5mm Square Trackball Switch Used on SparkFun Blackberry Trackballer Breakout <https://www.sparkfun.com/products/13169> SMD-4.6MMX2.8MM - 4.60mm x 2.80mm, surface mount Used on SparkFun SAMD21 Mini Breakout <https://www.sparkfun.com/products/13664> SMD-5.2MM, SMD-5.2-REDUNDANT - 5.2mm square, surface-mount Mini Pushbutton Switch - SMD <https://www.sparkfun.com/products/8720> (COM-08720) Used on Arduino Pro Mini <https://www.sparkfun.com/products/11114> REDUNDANT package connects both switch circuits together SMD-6.0X3.5MM - 6.0 x 3.5mm, surface mount Momentary Reset Switch SMD <https://www.sparkfun.com/products/8229> (COM-08229) SMD-6.2MM-TALL - 6.2mm square, surface mount Tactile Button - SMD (6mm) <https://www.sparkfun.com/products/12992> Used on SparkFun Digital Sandbox <https://www.sparkfun.com/products/12651> SMD-RIGHT-ANGLE - Right-angle, surface mount Used on SparkFun Block for Intel® Edison - Arduino <https://www.sparkfun.com/products/13036>; PROD_ID: SWCH-08247; SF_SKU: COM-08720
S5 = UltraLibrarianParts:EG1224; DESCRIPTION: Slide Switch SPDT Through Hole, Right Angle; DIGI-KEY_PART_NUMBER: EG2585-ND; MF: E-Switch; MP: EG1224; PACKAGE: None; PURCHASE-URL: https://pricing.snapeda.com/search/part/EG1224/?ref=eda
TP12-TP23 TP26 TP27 TP35 TP36 TP41 TP42 TP44 TP49 TP54 TP57-TP63 TP66 TP67 = SparkFun-Connectors:TEST-POINT: SparkFun Test Points Bare copper test points for troubleshooting or In-Circuit-Testing. These are used by our Production team for verifying production board runs using pogo-pins on test beds. SparkFun Products: SparkFun LSM9DS1 Breakout <https://www.sparkfun.com/products/13284> SparkFun PSOC <https://www.sparkfun.com/products/13714> SparkFun Load Cell Amplifier <https://www.sparkfun.com/products/13879>
U1 = ESP32-WROOM-32D:ESP32-WROOM-32D: Bluetooth, WiFi 802.11b/g/n, Bluetooth v4.2 + EDR, Class 1, 2 and 3 Transceiver Module 2.4GHz ~ 2.5GHz Integrated, Trace Surface Mount Check availability <https://pricing.snapeda.com/parts/ESP32-WROOM-32D/Espressif%20Systems/view-part?ref=eda>; AVAILABILITY: In Stock; DESCRIPTION: Bluetooth, WiFi 802.11b/g/n, Bluetooth v4.2 +EDR, Class 1, 2 and 3 Transceiver Module 2.4GHz ~ 2.5GHz Integrated; MF: Espressif Systems; MP: ESP32-WROOM-32D; PACKAGE: Module Espressif Systems; PRICE: None; PURCHASE-URL: https://pricing.snapeda.com/search/part/ESP32-WROOM-32D/?ref=eda
U2 = AP2111H-3.3TRG1:AP2111H-3.3TRG1; COPYRIGHT: Copyright (C) 2022 Ultra Librarian. All rights reserved.; DIGI-KEY_PART_NUMBER_1: AP2111H-3.3TRG1DICT-ND; DIGI-KEY_PART_NUMBER_2: AP2111H-3.3TRG1DIDKR-ND; DIGI-KEY_PART_NUMBER_3: AP2111H-3.3TRG1DITR-ND; MANUFACTURER_PART_NUMBER: AP2111H-3.3TRG1; MFR_NAME: Diodes Inc
U3 = CP2102N-A02-GQFN24:CP2102N-A02-GQFN24; COPYRIGHT: Copyright (C) 2022 Ultra Librarian. All rights reserved.; DIGI-KEY_PART_NUMBER_1: 336-5887-ND; MANUFACTURER_PART_NUMBER: CP2102N-A02-GQFN24; MFR_NAME: Silicon Labs
U8 = UltraLibrarianParts:BSS138; COPYRIGHT: Copyright (C) 2022 Ultra Librarian. All rights reserved.; DIGI-KEY_PART_NUMBER_1: 1801-BSS138CT-ND; DIGI-KEY_PART_NUMBER_2: 1801-BSS138DKR-ND; DIGI-KEY_PART_NUMBER_3: 1801-BSS138TR-ND; DIGI-KEY_PART_NUMBER_4: 2156-BSS138-ND; DIGI-KEY_PART_NUMBER_5: 2156-BSS138-OS-ND; DIGI-KEY_PART_NUMBER_6: BSS138-DIE-ND; DIGI-KEY_PART_NUMBER_7: BSS138CT-ND; DIGI-KEY_PART_NUMBER_8: BSS138DKR-ND; DIGI-KEY_PART_NUMBER_9: BSS138TR-ND; MANUFACTURER_PART_NUMBER: BSS138; MFR_NAME: onsemi
U9 = UltraLibrarianParts:TS2940CW50_RPG; DESCRIPTION: 1A 5V ULTRA LOW DROPOUT VOLTAGE REGULATOR; DIGI-KEY_PART_NUMBER: 1801-TS2940CW50RPGTR-ND; MF: Taiwan Semiconductor Corporation; MP: TS2940CW50 RPG; PACKAGE: SOT-223 Taiwan Semiconductor; PURCHASE-URL: https://pricing.snapeda.com/search/part/TS2940CW50 RPG/?ref=eda
U11 = UltraLibrarianParts:DS3231M+TRL; COPYRIGHT: Copyright (C) 2022 Ultra Librarian. All rights reserved.; DIGI-KEY_PART_NUMBER_1: DS3231M+TRL-ND; DIGI-KEY_PART_NUMBER_2: DS3231M+TRLCT-ND; DIGI-KEY_PART_NUMBER_3: DS3231M+TRLDKR-ND; DIGI-KEY_PART_NUMBER_4: DS3231M+TRLTR-ND; MANUFACTURER_PART_NUMBER: DS3231M+TRL; MFR_NAME: Maxim Integrated Products
X1 = adafruit_sensor:TMP235

## Board
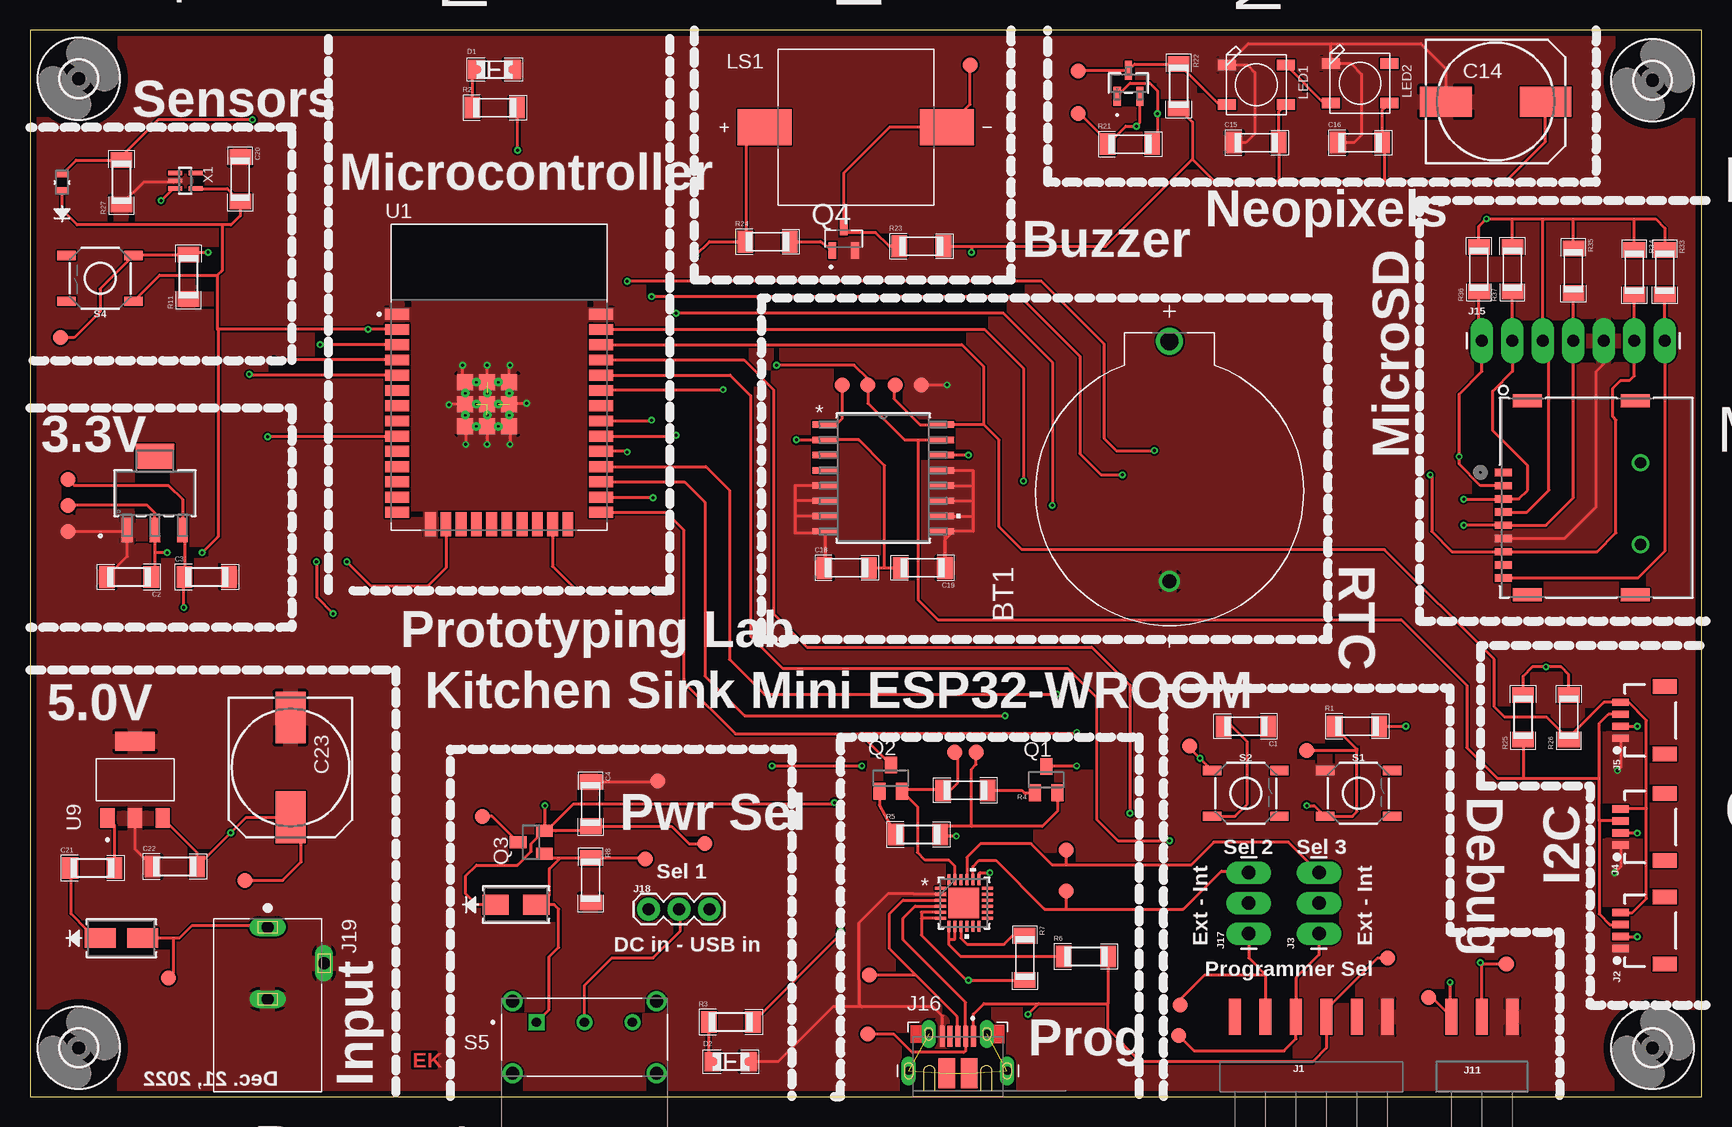
[diagram p6: board, top side]
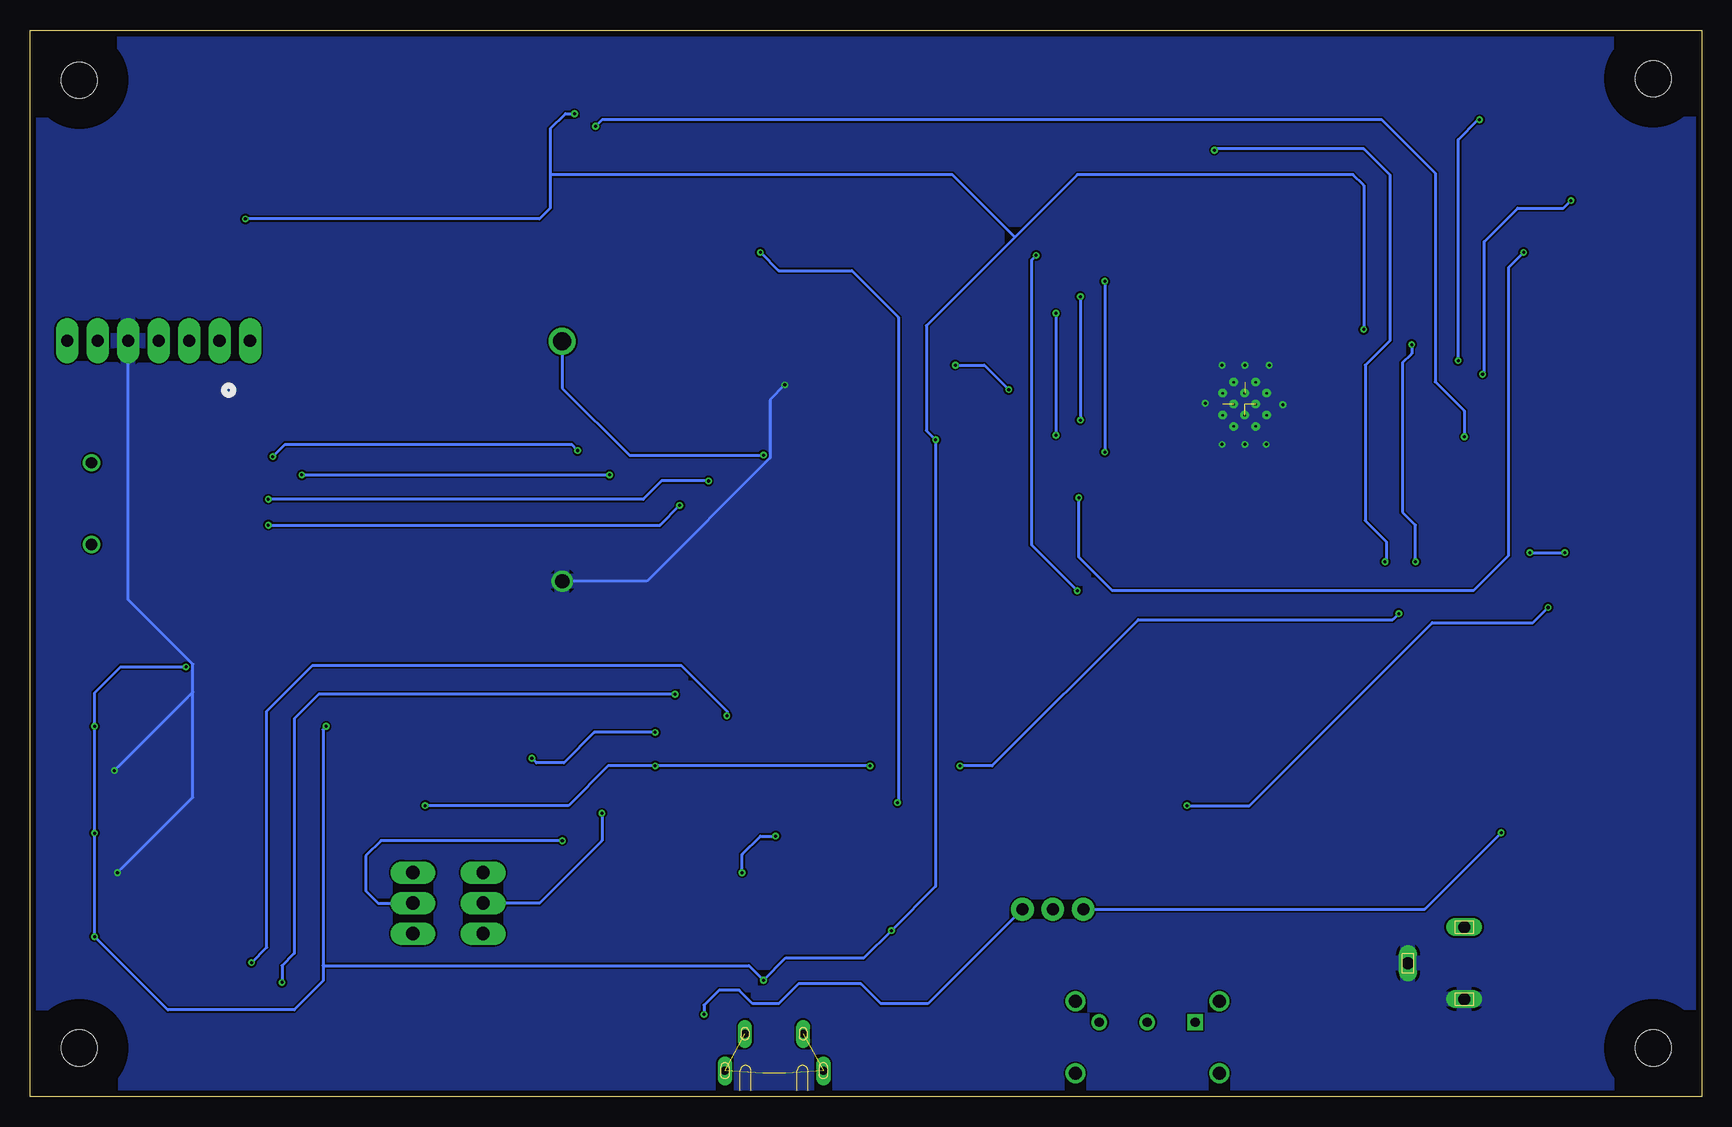
[diagram p7: board, bottom side, seen from below]

Size 139.37 x 88.89 mm. Coordinates in mm from the lower left corner, seen from the top.
Outline: 0,0 139.37,0 139.37,88.89 0,88.89 0,0
Copper layers (1*16): Top 0.035mm / dielectric 1.5mm / Bottom 0.035mm
Design rules "design_rule_check": minimum track width 6mil, minimum drill 10mil, track to track 6mil, track to pad 6mil, pad to pad 6mil, via to via 6mil, smd to smd 6mil, copper to edge 20mil, drill to drill 10mil, minimum pad ring 10mil, minimum via ring 6mil, stop-mask expansion 4mil, vias tented up to drill 0mil, thermal gap 10mil

### Footprints (pad centres in the part's own frame; a part is rotated, then mirrored left to right if it is on the bottom)
BAT_BS-7 = drill 1.5: + 10,0 | drill 1.17: - -10,0
1206 = smd 1.3 x 1.8: 1 -1.85,0; 2 1.85,0
140CLH-1010 = smd 4.3 x 2.5: + 4.15,0; - -4.15,0
1206.LED = smd 1.4 x 1.6: P$1 -1.5,0; P$2 1.5,0
DIODE_DO214AC = smd 2.184 x 1.651: 1 -1.702,0; 2 1.702,0
SMA_DIO-M = smd 2.561 x 1.63: 1 -1.768,0; 2 1.768,0
3,0 = hole 3: 0,0
1X06-SMD_RA_MALE_NO_HOLES = smd 1 x 3: 1 -6.35,5; 2 -3.81,5; 3 -1.27,5; 4 1.27,5; 5 3.81,5; 6 6.35,5
1X04_1MM_RA = smd 0.6 x 1.35: 1 -1.5,0; 2 -0.5,0; 3 0.5,0; 4 1.5,0 | smd 1.2 x 2: NC1 2.8,-3.675; NC2 -2.8,-3.675
1X03_LONGPADS = drill 1.118 pad 1.88 long: 1 0,0; 2 2.54,0; 3 5.08,0
1X03_SMD_RA_MALE = smd 1 x 3: 1 -2.54,5; 2 0,5; 3 2.54,5
MEM2075-00-140-01-A_GCT = smd 1.092 x 2.388: 10 -8.075,5.745; 11 8.075,5.745; 12 -8.075,-3.255; 13 8.075,-3.255 | drill 0.94 pad 1.448: 14 -3.886,-3.683; 15 2.921,-3.683 | smd 0.61 x 1.397: P1 2.105,7.745; P2 1.005,7.745; P3 -0.095,7.745; P4 -1.195,7.745; P5 -2.295,7.745; P6 -3.395,7.745; P7 -4.495,7.745; P8 -5.595,7.745; P9 -6.695,7.745
1X07_LONGPADS = drill 1.016 pad 1.88 long: 1 0,0; 2 2.54,0; 3 5.08,0; 4 7.62,0; 5 10.16,0; 6 12.7,0; 7 15.24,0
AMPHENOL_10103592-0001LF = smd 0.4 x 1.75: 1 1.3,2.875; 2 0.65,2.875; 3 0,2.875; 4 -0.65,2.875; 5 -1.3,2.875 | drill 0.65 pad 0.8 long: P1 -2.425,3.08; P2 2.425,3.08 | drill 0.7 pad 1.05 long: P3 -4.1,0; P6 4.1,0 | smd 1.375 x 2.5: P4 -0.938,-0.2; P5 0.938,-0.2
1X03 = drill 1.016 pad 1.88: 1 0,0; 2 2.54,0; 3 5.08,0
CUI_PJ-102AH = drill 1 long: 1 -6.5,0; 2 -0.5,0; 3 -3.5,4.7
WS2812B = smd 1.5 x 0.9: 1-VDD 2.45,-1.65; 2-DOUT 2.45,1.65; 3-GND -2.45,1.65; 4-DIN -2.45,-1.65
LED_77/TR8_EVE = smd 0.552 x 0.889: 1 -0.676,0; 2 0.676,0
XDCR_SMT-1341-T-HT-R = smd 4.5 x 3: N 7.6,0; P -7.6,0
SOT23 = smd 1 x 1.4: 1 -0.95,-1.1; 2 0.95,-1.1; 3 0,1.1
PN2222A-SOT-23 = smd 0.635 x 1.397: BASE -0.95,-0.98; COLLECTOR 0,0.98; EMITTER 0.95,-0.98
TACTILE_SWITCH_SMD_5.2MM = smd 1.524 x 0.762: 1 -2.794,1.905; 2 2.794,1.905; 3 -2.794,-1.905; 4 2.794,-1.905
SW_EG1224 = drill 0.79 square: 1 -4,1.25 | drill 0.79: 2 0,1.25; 3 4,1.25 | drill 1.09: S1 -6,-3; S2 6,-3; S3 6,3; S4 -6,3
PAD.03X.05 = smd 1.27 x 1.27: P$1 0,0
MODULE_ESP32-WROOM-32D = smd 2 x 0.9: 1 -8.5,5.26; 2 -8.5,3.99; 3 -8.5,2.72; 4 -8.5,1.45; 5 -8.5,0.18; 6 -8.5,-1.09; 7 -8.5,-2.36; 8 -8.5,-3.63; 9 -8.5,-4.9; 10 -8.5,-6.17; 11 -8.5,-7.44; 12 -8.5,-8.71; 13 -8.5,-9.98; 14 -8.5,-11.25; 25 8.5,-11.25; 26 8.5,-9.98; 27 8.5,-8.71; 28 8.5,-7.44; 29 8.5,-6.17; 30 8.5,-4.9; 31 8.5,-3.63; 32 8.5,-2.36; 33 8.5,-1.09; 34 8.5,0.18; 35 8.5,1.45; 36 8.5,2.72; 37 8.5,3.99; 38 8.5,5.26 | smd 0.9 x 2: 15 -5.715,-12.25; 16 -4.445,-12.25; 17 -3.175,-12.25; 18 -1.905,-12.25; 19 -0.635,-12.25; 20 0.635,-12.25; 21 1.905,-12.25; 22 3.175,-12.25; 23 4.445,-12.25; 24 5.715,-12.25 | smd 1.33 x 1.33: 39_1 -2.835,-0.405; 39_2 -1,-0.405; 39_3 0.835,-0.405; 39_4 -2.835,-2.24; 39_5 -1,-2.24; 39_6 0.835,-2.24; 39_7 -2.835,-4.075; 39_8 -1,-4.075; 39_9 0.835,-4.075 | drill 0.2 pad 0.3: 39_10 -1.917,-0.405; 39_11 -0.083,-0.405; 39_12 -2.835,-1.323; 39_13 -1,-1.323; 39_14 0.835,-1.323; 39_15 -1.917,-2.24; 39_16 -0.083,-2.24; 39_17 -2.835,-3.158; 39_18 -1,-3.158; 39_19 0.835,-3.158; 39_20 -1.917,-4.075; 39_21 -0.083,-4.075
SOT-223_DIO-M = smd 0.902 x 2.066: 1 -2.3,-3.076; 2 0,-3.076; 3 2.3,-3.076 | smd 3.202 x 2.066: 4 0,3.076
QFN24_CP2102N_SIL-M = smd 0.914 x 0.254: 1 -1.943,1.25; 2 -1.943,0.75; 3 -1.943,0.25; 4 -1.943,-0.25; 5 -1.943,-0.75; 6 -1.943,-1.25; 13 1.943,-1.25; 14 1.943,-0.75; 15 1.943,-0.25; 16 1.943,0.25; 17 1.943,0.75; 18 1.943,1.25 | smd 0.254 x 0.914: 7 -1.25,-1.943; 8 -0.75,-1.943; 9 -0.25,-1.943; 10 0.25,-1.943; 11 0.75,-1.943; 12 1.25,-1.943; 19 1.25,1.943; 20 0.75,1.943; 21 0.25,1.943; 22 -0.25,1.943; 23 -0.75,1.943; 24 -1.25,1.943 | smd 2.54 x 2.54: 25 0,0
SOT-23_3L_ONS-M = smd 0.61 x 1.575: 1 -0.953,-1.092; 2 0.953,-1.092; 3 0,1.092
VREG_TS2940CW50_RPG = smd 1.6 x 1.2: 1 -3.2,2.3; 2 -3.2,0; 3 -3.2,-2.3 | smd 1.6 x 3.3: 4 3.2,0
21-0042B_16_MXM-M = smd 2.083 x 0.533: 1 -4.839,4.445; 2 -4.839,3.175; 3 -4.839,1.905; 4 -4.839,0.635; 5 -4.839,-0.635; 6 -4.839,-1.905; 7 -4.839,-3.175; 8 -4.839,-4.445; 9 4.839,-4.445; 10 4.839,-3.175; 11 4.839,-1.905; 12 4.839,-0.635; 13 4.839,0.635; 14 4.839,1.905; 15 4.839,3.175; 16 4.839,4.445
SC70-5 = smd 0.35 x 1.15: 1 -0.65,-0.85; 2 0,-0.85; 3 0.65,-0.85; 4 0.65,0.85; 5 -0.65,0.85

### Placement (x,y rotation side)
BT1  95,52.96 90 top
C1  101.35,30.86 180 top
C2  8.26,43.31 180 top
C3  14.73,43.31 0 top
C4  46.74,24.38 270 top
C14  122.17,82.93 0 top
C15  102.23,79.5 0 top
C16  110.87,79.5 0 top
C18  68.07,44.07 0 top
C19  74.42,44.07 180 top
C20  17.53,76.45 270 top
C21  5.21,19.05 0 top
C22  12.06,19.18 0 top
C23  21.72,27.43 270 top
D1  38.73,85.6 0 top
D2  58.42,2.92 0 top
D4  40.51,16 0 top
D14  7.62,13.21 0 top
H1  135.25,84.71 0 top
H2  135.25,4.06 0 top
H3  4.06,84.84 0 top
H4  4.06,4.06 0 top
J1  106.81,1.65 0 top
J2  132.59,13.84 90 top
J3  107.44,13.59 90 top
J4  132.59,22.48 90 top
J5  132.59,31.37 90 top
J11  121.03,1.65 0 top
J14  130.56,49.91 90 top
J15  121.03,62.99 0 top
J16  77.34,2.16 0 top
J17  101.6,13.59 90 top
J18  51.56,15.62 0 top
J19  19.81,7.62 270 top
LED1  102.23,84.33 0 top
LED2  110.87,84.45 0 top
LED3  2.67,76.2 90 top
LS1  68.83,80.77 0 top
Q1  84.71,26.42 0 top
Q2  71.75,26.54 0 top
Q3  41.78,21.21 90 top
Q4  67.82,71.5 0 top
R1  110.62,30.86 0 top
R2  38.73,82.42 0 top
R3  58.42,6.22 0 top
R4  77.98,25.53 180 top
R5  74.04,21.84 0 top
R6  88.01,11.68 0 top
R7  82.93,11.56 270 top
R8  46.74,18.03 270 top
R11  13.21,68.33 90 top
R21  91.69,79.38 0 top
R22  95.76,84.2 270 top
R23  74.3,70.87 0 top
R24  61.47,71.25 0 top
R25  124.46,31.62 90 top
R26  128.27,31.62 90 top
R27  7.62,76.2 90 top
R33  136.27,68.71 270 top
R34  133.73,68.71 270 top
R35  128.65,68.83 270 top
R36  120.78,68.96 90 top
R37  123.57,68.96 90 top
S1  110.74,25.27 0 top
S2  101.35,25.27 0 top
S4  5.84,68.2 180 top
S5  46.23,4.95 0 top
TP12  113.16,11.56 0 top
TP13  95.76,5.08 0 top
TP14  95.89,7.62 0 top
TP15  116.59,8.26 0 top
TP16  123.06,11.05 0 top
TP17  69.85,5.21 90 top
TP18  69.98,10.16 90 top
TP19  86.36,20.57 90 top
TP20  86.36,17.14 90 top
TP21  51.31,19.81 90 top
TP22  37.72,23.37 90 top
TP23  56.26,21.08 90 top
TP26  3.17,51.44 0 top
TP27  3.17,49.28 0 top
TP35  3.17,47.12 0 top
TP36  52.32,26.29 90 top
TP41  2.54,63.25 0 top
TP42  78.36,85.98 0 top
TP44  87.38,81.92 0 top
TP49  87.38,85.47 0 top
TP54  67.69,59.31 0 top
TP57  72.14,59.31 0 top
TP58  69.85,59.31 0 top
TP59  74.3,59.31 0 top
TP60  106.43,28.83 0 top
TP61  96.65,29.21 0 top
TP62  77.09,28.7 90 top
TP63  78.87,28.7 90 top
TP66  11.56,9.91 0 top
TP67  17.91,18.03 0 top
U1  39.12,59.94 0 top
U2  10.41,50.29 0 top
U3  77.85,16.13 0 top
U8  91.57,84.45 0 top
U9  8.76,26.42 90 top
U11  71.12,51.56 0 top
X1  12.95,76.33 270 top

### Tracks (layer width: path | path; a pad name or v marks a point on that pad's centre or on a via)
5V  (via drill 0.25)
  Top 0.254: LED1.1-VDD 104.08,82.08 C15.2 104.08,76.38 104.14,76.33 | LED2.1-VDD 112.72,82.2 C16.2 112.9,79.32 112.9,76.33 | R22.2 96.9,81.21 96.9,78.11 | C14.+ 126.32,79.59 123.06,76.33 112.9,76.33 | 96.9,78.11 98.68,76.33 104.14,76.33 | 104.14,76.33 112.9,76.33 | 43.05,22.16 43.81,22.16 46.36,22.16 C4.2 53.47,22.53 54.92,21.08 TP23.P$1 | D4.1 37.21,16 36.32,16.89 36.32,18.41 37.21,19.3 40.64,19.3 41.78,20.45 41.78,21.08 42.86,22.16 | 42.86,22.16 Q3.2 | TP26.P$1 3.68,50.93 11.56,50.93 12.71,49.77 U2.3 12.88,47.05 C3.1 12.83,43.25 v12.83,40.77 | 42.93,22.23 42.93,22.2 Q3.2 | 42.93,22.23 v42.93,24.26 | R23.2 78.49,70.87 | 78.49,70.87 89.66,70.87 96.9,78.11 | 78.49,70.87 v78.49,70.36 | v67.06,24.51 66.93,24.38 45.28,24.38 43.05,22.16 | Q3.2 43.05,22.16 | 42.93,22.23 42.86,22.16 | 43.05,22.16 Q3.2
  Bottom 0.254: v42.93,24.26 37.72,24.26 22.48,39.5 14.1,39.5 v12.83,40.77 | v78.49,70.36 76.96,68.83 70.87,68.83 66.98,64.95 66.98,24.59 v67.06,24.51
5V_DC_IN  (via drill 0.25)
  Top 0.254: U9.3 13.91,20.36 C22.2 v16.74,22 18.02,23.28 C23.+ 22.61,22.39 22.61,19.56 21.08,18.03 TP67.P$1
  Bottom 0.254: J18.1 23.11,15.62 v16.74,22
BUZZER  (via drill 0.25)
  Top 0.254: LS1.P 59.69,79.23 59.69,71.32 R24.1 56.64,71.25 v55.5,70.1 | v52.07,42.16 45.59,42.16 43.56,44.2 U1.23
  Bottom 0.254: v52.07,42.16 55.88,45.97 55.88,69.72 v55.5,70.1
CP_RX
  Top 0.254: U3.20 78.6,19.16 79.12,19.68 80.52,19.68 84.58,15.62 86.36,15.62 | TP20.P$1 86.36,15.62 | 86.36,15.62 96.14,15.62 99.31,18.8 101.47,18.8 J17.3
CP_TX
  Top 0.254: U3.21 78.1,19.93 79.25,21.08 83.44,21.08 85.22,19.3 86.36,19.3 | TP19.P$1 86.36,19.3 | J3.3 104.9,21.21 98.68,21.21 96.77,19.3 86.36,19.3
DC_JACK
  Top 0.254: J19.1 19.81,14.22 13.46,14.22 12.45,13.21 11.94,13.21 | 11.94,13.21 D14.2 | TP66.P$1 11.94,10.29 11.94,13.21
DTR
  Top 0.254: U3.23 77.1,19.21 76.59,19.72 74.61,19.72 73.97,20.36 73.97,24.17 Q2.2 72.83,25.57 76.08,25.57 R4.2 76.25,25.65 76.83,25.65 77.34,26.16 77.34,28.45 TP62.P$1
EN  (via drill 0.25)
  Top 0.254: 110.62,28.83 110.62,23.75 110.24,23.37 S1.3 107.06,24.26 v106.43,24.26 | 110.62,28.83 110.62,28.96 108.77,30.81 R1.1 | 110.62,28.83 TP60.P$1 | U1.3 24.2,62.66 v24.19,62.67 | v23.88,44.58 23.88,41.66 v25.27,40.26 | v61.85,27.56 v69.34,27.56 | v87.25,27.56 87.21,27.52 Q1.3
  Bottom 0.254: v24.19,62.67 24.19,61.91 24.96,61.15 24.96,48.7 23.88,47.62 v23.88,44.58 | v25.27,40.26 25.78,39.75 46.99,39.75 59.18,27.56 v61.85,27.56 | v69.34,27.56 v87.25,27.56 91.19,27.56 94.49,24.26 v106.43,24.26
FTDI_RX
  Top 0.254: 103,10.16 101.6,11.56 J17.1 | 103,10.16 J1.2 | TP14.P$1 95.89,8.13 97.92,10.16 103,10.16
FTDI_TX
  Top 0.254: TP13.P$1 97.03,3.81 104.52,3.81 105.54,4.83 J1.3 105.54,9.91 107.44,11.81 J3.1
GND  (via drill 0.25)  (4 unrouted)
  Top 0.254: C4.1 52.27,26.23 TP36.P$1 | C22.1 8.76,20.63 U9.2 | TP35.P$1 8.02,47.12 U2.1 8.11,45.02 C2.2 | U11.5 63.75,50.93 63.75,49.53 | 63.75,49.53 63.75,48.39 | 63.75,48.39 63.75,46.99 66.15,46.99 U11.8 66.28,44.13 C18.1 | U11.7 63.75,48.39 | U11.6 63.88,49.66 63.75,49.53 | U11.13 78.61,52.2 78.61,50.93 | 78.61,50.93 78.61,49.66 | 78.61,49.66 78.61,48.39 | 78.61,48.39 78.61,47.12 76.96,47.12 | 76.96,47.12 U11.9 76.27,46.8 76.27,44.32 | U11.10 78.61,48.39 | U11.11 78.61,49.66 | U11.12 78.61,50.93 | 76.27,44.32 C19.1 76.27,46.43 76.96,47.12 | 76.45,44.14 76.27,44.32 | C15.1 101.35,79.5 102.11,80.26 102.11,85.34 101.47,85.98 LED1.3-GND 101.55,87.75 108.46,87.75 | C16.1 110.36,79.5 111,80.14 111,85.22 110.11,86.11 LED2.3-GND 108.46,86.14 108.46,87.75 | 108.46,87.75 115.95,87.75 118.02,85.67 C14.- | 123.7,6.52 J11.3 | J14.P6 127.92,46.52 130.56,49.15 130.56,60.45 131.19,61.09 J15.5 | J16.5 76.04,6.7 | 76.04,6.7 76.07,6.73 | 76.04,6.7 75.25,7.49 69.34,7.49 | D2.P$2 62.36,2.92 66.93,7.49 69.34,7.49 | U3.2 73.67,16.88 73.66,16.89 71.5,16.89 69.06,14.45 69.06,9.78 69.09,9.76 69.09,7.75 69.34,7.49 | X1.2 11.98,76.2 9.47,76.2 R27.1 | U1.39_1 36.07,59.75 v36.07,60.96 | U1.39_2 38.12,60.94 v38.1,60.96 | 39.95,59.56 U1.39_3 U1.39_6 | 39.95,59.56 39.95,60.91 v40.01,60.96 | U1.39_6 40.03,57.78 v41.4,57.78 | U1.39_9 40.01,55.81 v40.01,54.36 | U1.39_8 38.12,54.37 v38.1,54.36 | U1.39_7 36.32,55.83 v36.32,54.36 | U1.39_4 34.97,57.7 v34.92,57.66 | U1.39_5 U1.39_2 | U1.39_1 U1.39_2 | U1.39_2 38.14,59.56 39.95,59.56 | U1.39_6 U1.39_5 | U1.39_5 U1.39_4 | U1.39_4 U1.39_7 | U1.39_7 U1.39_8 | U1.39_8 U1.39_9 | U1.39_9 U1.39_6 | U1.39_5 U1.39_8 | U1.39_1 U1.39_4
  Top 0.254: J4.1 132.59,19.18 v132.08,18.67 | J5.1 132.59,27.43 v132.33,27.18 | TP59.P$1 v76.45,59.31
  Bottom 0.254: v132.08,18.67 125.81,24.94 125.81,33.71 | J15.5 131.19,41.43 125.81,36.05 125.81,33.71 | v132.33,27.18 125.81,33.71 | v76.45,59.31 77.67,58.09 77.67,53.24 87.95,42.96 BT1.-
  pour Top: -10.16,92.71 -10.16,-6.35 144.78,-6.35 144.78,93.98 -10.16,93.98
  pour Bottom: -11.43,93.98 -11.43,-7.62 146.05,-7.62 146.05,95.25 -11.43,95.25
I2C_SCL
  Top 0.254: TP57.P$1 72.01,59.31 72.01,58.17 74.17,56.01 U11.16 79.5,56.01 | J2.4 133.58,15.34 134.75,16.51 134.75,24 | 134.75,24 132.61,24 J4.4 | 134.75,24 134.75,31.37 133.22,32.89 132.61,32.89 J5.4 131.19,32.87 128.27,29.95 R26.1 126.42,31.62 122.94,31.62 122.05,32.51 122.05,36.45 112.9,45.59 82.68,45.59 80.77,47.5 80.77,54.74 79.5,56.01 | 79.5,56.01 79.5,60.83 77.67,62.66 U1.36
I2C_SDA  (via drill 0.25)
  Top 0.254: 74.04,54.74 72.9,54.74 69.85,57.78 TP58.P$1 69.85,59.82 68.71,60.96 v62.23,60.96 | 74.04,54.74 U11.15 | J5.3 131.56,31.87 130.81,31.11 130.81,26.54 | J4.3 130.82,22.98 130.81,22.97 | 130.81,22.97 130.81,15.24 131.71,14.34 J2.3 | R25.1 124.46,26.54 | 124.46,26.54 130.81,26.54 | 130.81,22.97 130.81,26.54 | v57.78,58.93 47.69,58.93 U1.33 | 124.46,26.54 122.3,26.54 119.76,29.08 119.76,34.29 114.3,39.75 75.69,39.75 74.04,41.4 74.04,54.74
  Bottom 0.254: v62.23,60.96 59.82,60.96 v57.78,58.93
IO0  (via drill 0.25)
  Top 0.254: S2.1 v97.54,28.19 96.65,29.08 TP61.P$1 | U1.25 53.03,48.69 54.48,47.24 54.48,34.54 58.8,30.23 69.17,30.23 | 69.17,30.23 Q2.3 | 69.17,30.23 87.12,30.23 v87.25,30.35
  Bottom 0.254: v87.25,30.35 92.33,30.35 94.87,27.81 97.16,27.81 v97.54,28.19
LED  (via drill 0.25)
  Top 0.254: U1.16 34.67,44.07 33.15,42.55 28.45,42.55 v26.42,44.58 | v40.64,78.87 40.64,82.37 R2.2
  Bottom 0.254: v26.42,44.58 26.29,44.7 26.29,46.23 28.07,48.01 28.07,60.96 26.04,62.99 26.04,76.83 28.19,78.99 40.51,78.99 v40.64,78.87
LIGHT_SENS  (via drill 0.25)
  Top 0.254: LED3.2 3.84,78.05 7.31,78.05 | 7.31,78.05 R27.2 | U1.4 20.37,61.39 v20.32,61.34 | v18.54,81.41 10.67,81.41 7.31,78.05
  Bottom 0.254: v20.32,61.34 20.32,79.76 18.67,81.41 v18.54,81.41
N$1
  Top 0.254: R6.1 86.18,11.7 77.58,11.7 76.58,12.7 76.58,13.08 | U3.8 77.09,14.17 77.09,13.08 76.58,13.08 | U3.7 76.58,14.17 76.58,13.08
N$3
  Top 0.254: S2.3 100.46,23.37 101.47,24.38 101.47,29.59 100.2,30.86 C1.2
N$5
  Top 0.254: J16.3 77.3,5.08 77.3,6.66 73.79,10.17 | 73.79,10.17 71.63,12.33 71.63,15.24 72.77,16.38 U3.3 | TP18.P$1 73.79,10.16 73.79,10.17
N$6
  Top 0.254: U3.4 73.79,15.88 72.77,14.86 72.77,13.08 77.99,7.86 J16.2 77.99,3.83 77.85,3.68 73.53,3.68 72.01,5.21 TP17.P$1
N$7
  Top 0.254: R2.1 36.88,85.25 D1.P$1
N$9
  Top 0.254: D2.P$1 56.57,2.57 R3.1
N$10
  Top 0.254: Q1.1 82.89,25.32 82.68,25.53 R4.1
N$11
  Top 0.254: Q2.1 70.81,24.32 R5.1
N$12
  Top 0.254: U3.9 77.6,13.21 78.11,12.7 81.21,12.7 81.92,13.41 R7.1
N$18
  Top 0.254: TP54.P$1 67.69,56.52 67.18,56.01 U11.1
N$24  (via drill 0.25)
  Top 0.254: v78.23,53.47 U11.14
  Bottom 0.254: BT1.+ 95,59.05 89.41,53.47 v78.23,53.47
N$30
  Top 0.254: LED1.4-DIN 99.13,82.68 R22.1 92.07,86.05 U8.3 87.45,85.55 TP49.P$1
N$32
  Top 0.254: C21.2 7.06,22.62 U9.1
N$33
  Top 0.254: TP42.P$1 78.36,82.7 LS1.N 71.63,80.77 67.82,76.96 Q4.COLLECTOR 67.82,71.88 67.94,72.01 70.48,72.01 71.63,70.87 R23.1
N$34
  Top 0.254: LED1.2-DOUT 107.86,82.81 LED2.4-DIN
N$35
  Top 0.254: R24.2 65.89,71.25 Q4.BASE
N$43
  Top 0.254: D14.1 5.19,13.87 4.79,13.87 3.43,15.23 3.43,18.98 C21.1
NEOPIXELS  (via drill 0.25)
  Top 0.254: U8.2 92.52,81.16 v92.23,80.87 91.34,80.87 R21.1 89.84,79.57 87.5,81.92 TP44.P$1 | v19.81,54.99 19.86,55.04 U1.9
  Bottom 0.254: v92.23,80.87 91.69,81.41 26.67,81.41 22.23,76.96 22.23,59.56 19.81,57.15 v19.81,54.99
PWR_INPUT
  Top 0.254: S5.2 46.23,9.27 48.51,11.56 51.94,11.56 54.23,13.84 54.23,15.49 J18.2
PWR_ON
  Top 0.254: 44.2,19.88 R8.1 51.24,19.88 TP21.P$1 | 44.2,19.88 43.26,19.88 Q3.1 | 44.2,19.88 43.31,19 43.31,16.79 43.19,16.68 42.89,16.68 D4.2 43.69,16 44.07,15.62 44.07,12.45 43.24,11.62 43.24,7.22 S5.1
RTS  (via drill 0.25)
  Top 0.254: Q1.2 85.66,23.79 84.39,22.52 78.49,22.52 | 78.49,22.52 76.26,22.52 R5.2 76.02,21.72 v77.22,21.72 | 78.49,22.52 78.49,27.3 78.87,27.69 TP63.P$1 | U3.19 79.1,18.58 79.19,18.67 v80.01,18.67
  Bottom 0.254: v80.01,18.67 80.01,20.19 78.49,21.72 v77.22,21.72
RX  (via drill 0.25)
  Top 0.254: U1.35 59.51,61.39 61.98,58.93 61.98,40.26 64.77,37.47 88.52,37.47 91.69,34.29 v91.69,23.62
  Bottom 0.254: v91.69,23.62 91.69,21.34 96.9,16.13 J17.2
RX2  (via drill 0.25)
  Top 0.254: TP16.P$1 121.03,11.05 | J11.2 121.03,11.05 | 121.03,11.05 v120.9,11.18 | U1.27 54.56,51.23 56.26,49.53 56.26,35.05 59.56,31.75 v81.28,31.75
  Bottom 0.254: v120.9,11.18 119.63,12.45 119.63,32.13 115.82,35.94 85.09,35.94 81.28,32.13 v81.28,31.75
SHIELD  (5 unrouted)
SNAP_BUTTON  (via drill 0.25)
  Top 0.254: TP41.P$1 3.68,63.25 5.84,65.41 5.84,67.31 S4.3 8.71,70.18 R11.2 13.39,70.36 v14.86,70.36 | v51.94,49.91 47.67,49.91 U1.26
  Bottom 0.254: v14.86,70.36 16.13,69.09 16.13,45.09 19.05,42.16 49.15,42.16 51.94,44.96 v51.94,49.91
SPI_CD
  Top 0.254: J14.P9 134.02,43.22 136.27,45.47 J15.7 R33.2
SPI_MISO  (via drill 0.25)
  Top 0.254: R34.2 J15.6 133.73,60.07 133.35,59.69 132.59,59.69 131.95,59.05 131.95,56.64 132.21,56.39 132.21,46.99 130.63,45.42 J14.P7 118.54,45.42 116.84,47.12 116.84,51.69 v116.71,51.82 | U1.31 51.82,56.31 v51.82,56.39 | v51.82,66.67 82.55,66.67 87.5,61.72 87.5,53.59 89.28,51.82 v91.06,51.82
  Bottom 0.254: v51.82,66.67 v51.82,56.39 | v116.71,51.82 v91.06,51.82
SPI_MOSI  (via drill 0.25)
  Top 0.254: R37.1 J15.2 123.57,60.45 121.92,58.8 121.92,55.5 124.84,52.58 124.84,50.55 124.11,49.82 J14.P3 122.78,49.78 v119.51,49.78 | U1.37 79.58,63.93 82.8,60.71 v82.8,51.31
  Bottom 0.254: v82.8,51.31 86.74,51.31 88.27,49.78 v119.51,49.78
SPI_SCLK  (via drill 0.25)
  Top 0.254: R35.2 J15.4 128.65,49.91 126.36,47.62 J14.P5 v119.52,47.62 v119.51,47.62 | v85.22,49.28 85.22,61.21 81.15,65.28 v53.85,65.28 | U1.30 53.77,55.04 v53.85,55.12
  Bottom 0.254: v119.51,47.62 86.87,47.62 v85.22,49.28 | v53.85,65.28 v53.85,55.12
SPI_SS  (via drill 0.25)
  Top 0.254: J14.P2 120.92,50.92 119.13,52.7 v119.13,53.34 119.13,58.55 121.03,60.45 J15.1 120.78,63.25 R36.1 | v49.78,53.72 49.73,53.77 U1.29 | v93.73,53.85 90.55,53.85 89.53,54.86 89.53,62.74 84.33,67.94 v49.78,67.94
  Bottom 0.254: v49.78,67.94 v49.78,53.72 | v93.73,53.85 94.23,54.36 118.11,54.36 v119.13,53.34
TEMP_SENS  (via drill 0.25)
  Top 0.254: X1.3 11.92,75.68 v10.92,74.68 | U1.5 18.36,60.12 v18.29,60.2
  Bottom 0.254: v18.29,60.2 18.16,60.33 18.16,71.25 15.37,74.04 11.56,74.04 v10.92,74.68
TX  (via drill 0.25)
  Top 0.254: U1.34 58.37,60.12 60.07,58.42 60.07,38.35 62.74,35.69 86.49,35.69 88.9,33.27 88.9,23.11 90.68,21.34 v95,21.34
  Bottom 0.254: J3.2 110.36,16.13 111.38,17.14 111.38,20.07 110.11,21.34 v95,21.34
TX2  (via drill 0.25)
  Top 0.254: 118.36,6.78 116.89,8.26 TP15.P$1 | U1.28 56.34,52.5 58.29,50.55 58.29,36.45 61.21,33.53 v85.6,33.53 | v118.36,9.53 118.36,6.78 | 118.36,6.78 J11.1
  Bottom 0.254: v85.6,33.53 115.32,33.53 117.35,31.5 117.35,11.94 118.36,10.92 v118.36,9.53
V_BATT
  Top 0.254: Q3.3 39.88,22.01 38.52,23.37 TP22.P$1
V_USB  (via drill 0.25)
  Top 0.254: J16.1 78.64,6.89 79.5,7.75 84.07,7.75 | 84.07,7.75 89.86,7.75 | TP12.P$1 112.35,11.56 108.08,7.29 J1.4 108.08,4.06 106.93,2.92 92.58,2.92 89.86,5.64 89.86,7.75 | v83.19,6.86 84.07,7.75 | R6.2 89.86,7.75
  Bottom 0.254: J18.3 64.52,7.75 68.45,7.75 70.1,9.4 75.31,9.4 76.96,7.75 79.12,7.75 80.26,8.89 81.92,8.89 83.19,7.62 v83.19,6.86
VCC  (via drill 0.25)
  Top 0.254: U3.5 74.31,15.38 74.3,15.37 74.3,14.86 | U3.6 74.31,14.88 74.3,14.86 | R7.2 v78.23,9.71 78.05,9.71 74.3,13.46 74.3,14.86 | 10.41,45.34 U2.2 10.41,48.64 9.78,49.28 TP27.P$1 | 10.41,45.34 10.41,43.62 C2.1 | X1.4 16.45,75.68 C20.2 17.53,73.41 16.76,72.64 16,72.64 | 16,72.64 3.94,72.64 2.67,73.91 LED3.1 | S4.1 10.79,68.45 15.62,68.45 | C18.2 71.25,44.07 | 71.25,44.07 C19.2 | 71.25,44.07 71.25,52.58 69.09,54.74 U11.2 v63.88,54.74 | U8.1 91.71,84.45 93.34,84.45 93.98,83.82 v93.98,81.92 93.98,79.81 R21.2 | R25.2 124.46,35.05 125.22,35.81 v126.36,35.81 127.64,35.81 128.27,35.18 R26.2 | J14.P4 124.79,48.72 126.62,50.55 126.62,62.48 J15.3 126.11,73.03 125.98,73.15 | R36.2 120.78,72.52 v121.41,73.15 123.57,73.15 | 123.57,73.15 125.98,73.15 | 125.98,73.15 128.65,73.15 | 128.65,73.15 133.73,73.15 | 133.73,73.15 135.51,73.15 136.27,72.39 R33.1 | R37.2 123.57,73.15 | R35.1 128.65,73.15 | R34.1 133.73,73.15 | U1.2 v28.19,63.93 15.67,63.93 | 15.67,63.93 15.62,63.93 15.62,68.45 | 15.67,63.93 15.67,46.66 v14.35,45.34 | v11.43,45.34 10.41,45.34 | R1.2 v114.68,30.86 | J2.2 v133.99,13.34 | J4.2 133.98,21.98 v133.99,21.97 | J5.2 v133.99,30.86 | 15.62,68.45 16,68.83 16,72.64 | R3.2 67.56,13.52 v67.56,13.84
  Bottom 0.254: v14.35,45.34 v11.43,45.34 | v28.19,63.93 28.19,75.95 29.08,76.83 52.07,76.83 57.28,71.63 | 57.28,71.63 62.48,76.83 95.89,76.83 96.01,76.71 | 57.28,71.63 64.64,64.26 64.64,55.5 v63.88,54.74 63.88,17.53 v67.56,13.84 69.85,11.56 76.38,11.56 v78.23,9.71 79.45,10.92 114.94,10.92 | v121.41,73.15 96.9,73.15 96.01,74.04 96.01,76.71 | 96.01,76.71 96.01,80.64 94.74,81.92 v93.98,81.92 | v126.36,35.81 131.83,35.81 133.99,33.66 v133.99,30.86 v133.99,21.97 v133.99,13.34 127.89,7.24 117.35,7.24 114.94,9.65 114.94,10.92 | v114.68,30.86 114.94,30.61 114.94,10.92

### Text on the board
Top: EK
tNames: Light Sensor | Temperature Sensor | Buzzer | Microcontroller | Neopixels | Sensors | Microcontroller | RTC | Neopixels | Buzzer | Button | 3.3V | Micro SD | MicroSD | 3.3V Regulator | RTC | Prototyping Lab | Kitchen Sink Mini ESP32-WROOM | 5.0V | Debug | 5V Regulator | Pwr Sel | Qwiic Headers | Sel 2 | Sel 3 | Sel 1 | I2C | Ext - Int | Ext - Int | DC in - USB in | Programmer Sel | Prog | Dec. 21, 2022 | Input | Power Input | Programmer